# EAGLE design MAAV_Vehicle_12v0 (EAGLE 6.2)

## Sheet 1 of 7
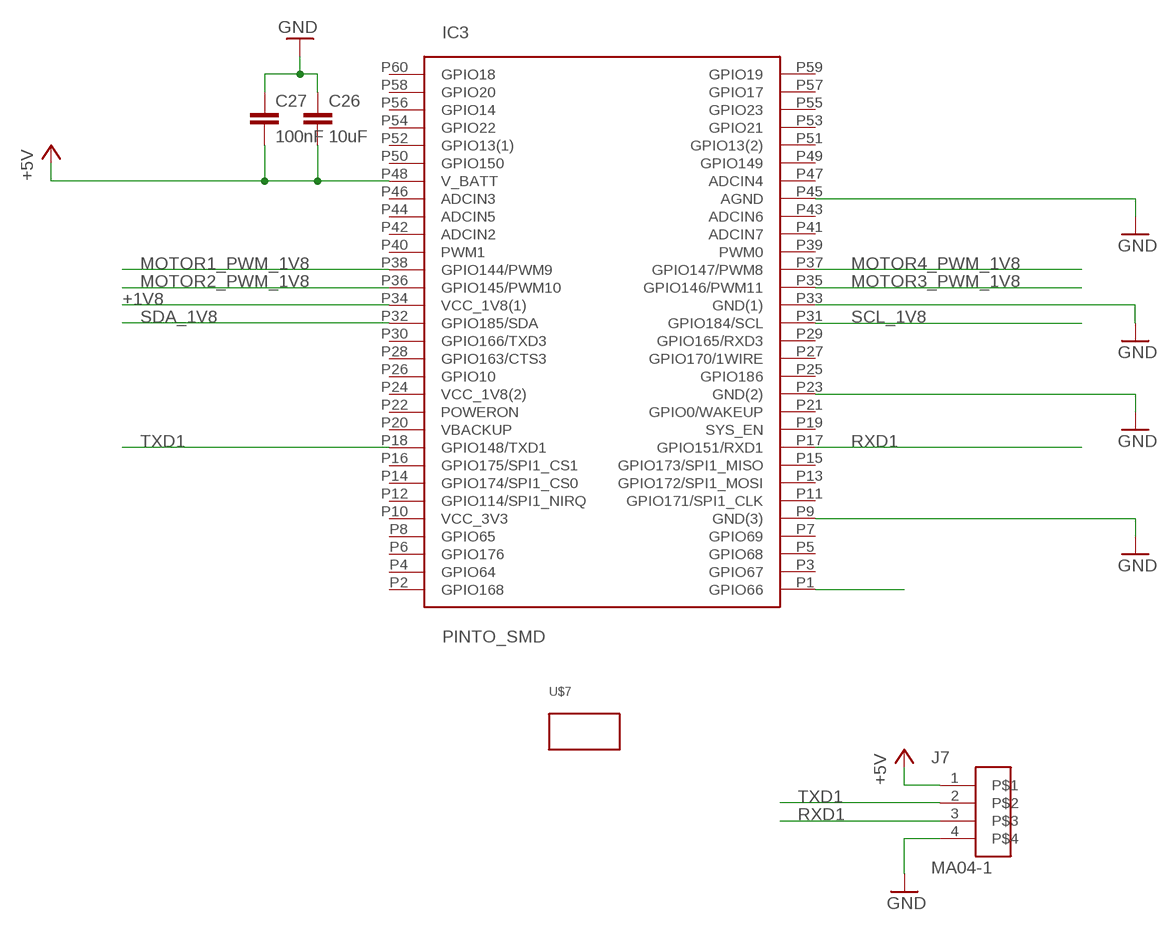
[diagram p0: schematic, sheet 1]

### Parts
C26  10uF  CAP0603-CAP  [0603-CAP]
C27  100nF  CAP0603-CAP  [0603-CAP]
IC3  PINTO_SMD  [PINTO_SMD]
J7  MA04-1  [455-1751-1-ND]
U$7  IMU  [IMU]

### Nets
+1V8: IC3.P34(VCC_1V8(1)) ; also sheet 2
+5V: C26.2 C27.2 IC3.P48(V_BATT) J7.1 ; also sheet 2,3,4,6,7
GND: C26.1 C27.1 IC3.P9(GND(3)) IC3.P23(GND(2)) IC3.P33(GND(1)) IC3.P45(AGND) J7.4 ; also sheet 3,4,5,6,7
MOTOR1_PWM_1V8: IC3.P38(GPIO144/PWM9) ; also sheet 2
MOTOR2_PWM_1V8: IC3.P36(GPIO145/PWM10) ; also sheet 2
MOTOR3_PWM_1V8: IC3.P35(GPIO146/PWM11) ; also sheet 2
MOTOR4_PWM_1V8: IC3.P37(GPIO147/PWM8) ; also sheet 2
N$1: IC3.P1(GPIO66)
RXD1: IC3.P17(GPIO151/RXD1) J7.3
SCL_1V8: IC3.P31(GPIO184/SCL) ; also sheet 2
SDA_1V8: IC3.P32(GPIO185/SDA) ; also sheet 2
TXD1: IC3.P18(GPIO148/TXD1) J7.2
Unconnected: IC3.P2(GPIO168) IC3.P3(GPIO67) IC3.P4(GPIO64) IC3.P5(GPIO68) IC3.P6(GPIO176) IC3.P7(GPIO69) IC3.P8(GPIO65) IC3.P10(VCC_3V3) IC3.P11(GPIO171/SPI1_CLK) IC3.P12(GPIO114/SPI1_NIRQ) IC3.P13(GPIO172/SPI1_MOSI) IC3.P14(GPIO174/SPI1_CS0) IC3.P15(GPIO173/SPI1_MISO) IC3.P16(GPIO175/SPI1_CS1) IC3.P19(SYS_EN) IC3.P20(VBACKUP) IC3.P21(GPIO0/WAKEUP) IC3.P22(POWERON) IC3.P24(VCC_1V8(2)) IC3.P25(GPIO186) IC3.P26(GPIO10) IC3.P27(GPIO170/1WIRE) IC3.P28(GPIO163/CTS3) IC3.P29(GPIO165/RXD3) IC3.P30(GPIO166/TXD3) IC3.P39(PWM0) IC3.P40(PWM1) IC3.P41(ADCIN7) IC3.P42(ADCIN2) IC3.P43(ADCIN6) IC3.P44(ADCIN5) IC3.P46(ADCIN3) IC3.P47(ADCIN4) IC3.P49(GPIO149) IC3.P50(GPIO150) IC3.P51(GPIO13(2)) IC3.P52(GPIO13(1)) IC3.P53(GPIO21) IC3.P54(GPIO22) IC3.P55(GPIO23) IC3.P56(GPIO14) IC3.P57(GPIO17) IC3.P58(GPIO20) IC3.P59(GPIO19) IC3.P60(GPIO18)

## Sheet 2 of 7
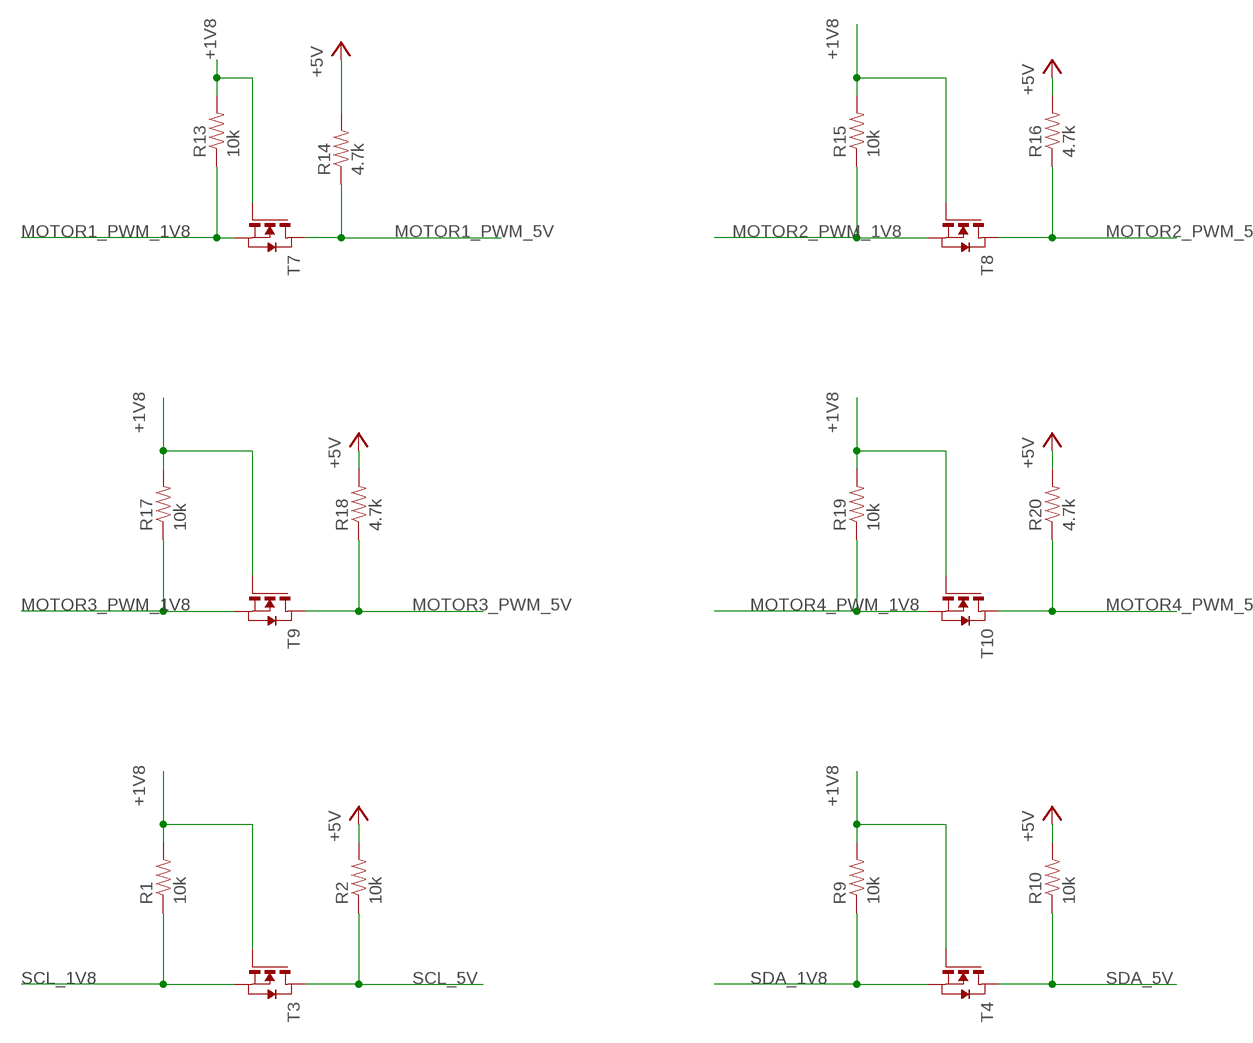
[diagram p1: schematic, sheet 2]

### Parts
R1  10k  RESISTOR0603-RES  [0603-RES]
R2  10k  RESISTOR0603-RES  [0603-RES]
R9  10k  RESISTOR0603-RES  [0603-RES]
R10  10k  RESISTOR0603-RES  [0603-RES]
R13  10k  RESISTOR0603-RES  [0603-RES]
R14  4.7k  RESISTOR0603-RES  [0603-RES]
R15  10k  RESISTOR0603-RES  [0603-RES]
R16  4.7k  RESISTOR0603-RES  [0603-RES]
R17  10k  RESISTOR0603-RES  [0603-RES]
R18  4.7k  RESISTOR0603-RES  [0603-RES]
R19  10k  RESISTOR0603-RES  [0603-RES]
R20  4.7k  RESISTOR0603-RES  [0603-RES]
T3  NMOSSOT23  [SOT-23]
T4  NMOSSOT23  [SOT-23]
T7  NMOSSOT23  [SOT-23]
T8  NMOSSOT23  [SOT-23]
T9  NMOSSOT23  [SOT-23]
T10  NMOSSOT23  [SOT-23]

### Nets
+1V8: R1.2 R9.2 R13.2 R15.2 R17.2 R19.2 T3.3(G) T4.3(G) T7.3(G) T8.3(G) T9.3(G) T10.3(G) ; also sheet 1
+5V: R2.2 R10.2 R14.2 R16.2 R18.2 R20.2 ; also sheet 1,3,4,6,7
MOTOR1_PWM_1V8: R13.1 T7.2(S) ; also sheet 1
MOTOR1_PWM_5V: R14.1 T7.1(D) ; also sheet 5
MOTOR2_PWM_1V8: R15.1 T8.2(S) ; also sheet 1
MOTOR2_PWM_5V: R16.1 T8.1(D) ; also sheet 5
MOTOR3_PWM_1V8: R17.1 T9.2(S) ; also sheet 1
MOTOR3_PWM_5V: R18.1 T9.1(D) ; also sheet 5
MOTOR4_PWM_1V8: R19.1 T10.2(S) ; also sheet 1
MOTOR4_PWM_5V: R20.1 T10.1(D) ; also sheet 5
SCL_1V8: R1.1 T3.2(S) ; also sheet 1
SCL_5V: R2.1 T3.1(D) ; also sheet 3
SDA_1V8: R9.1 T4.2(S) ; also sheet 1
SDA_5V: R10.1 T4.1(D) ; also sheet 3

## Sheet 3 of 7
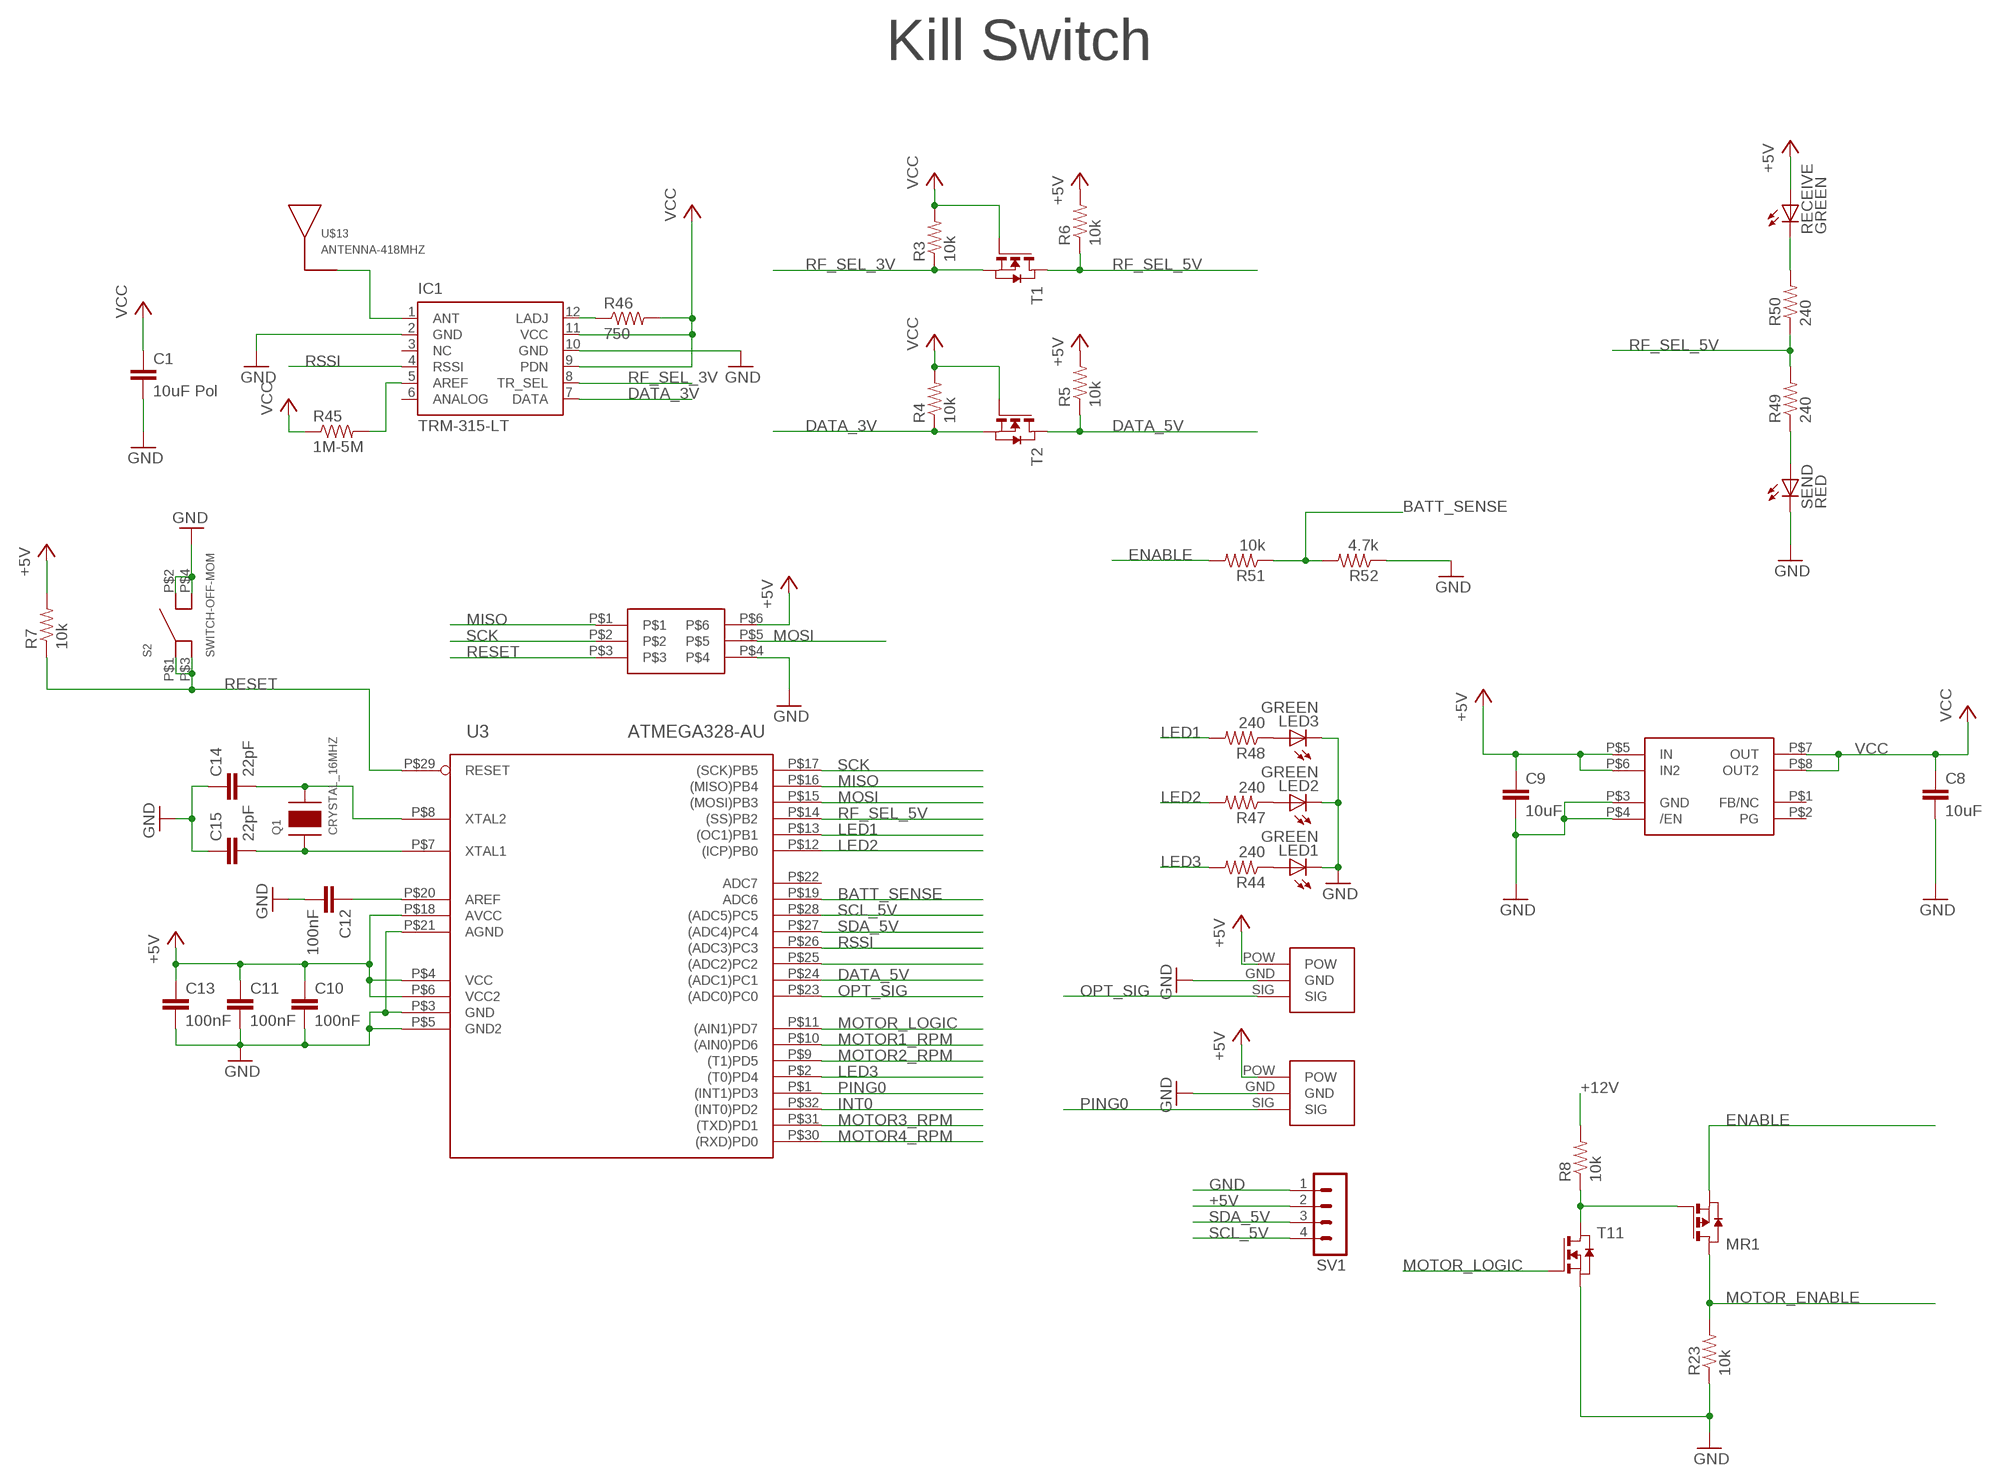
[diagram p2: schematic, sheet 3]

### Parts
C1  10uF Pol  CAP0805  [0805]
C8  10uF  CAP0805  [0805]
C9  10uF  CAP0603-CAP  [0603-CAP]
C10  100nF  CAP0603-CAP  [0603-CAP]
C11  100nF  CAP0603-CAP  [0603-CAP]
C12  100nF  CAP0603-CAP  [0603-CAP]
C13  100nF  CAP0603-CAP  [0603-CAP]
C14  22pF  CAP0603-CAP  [0603-CAP]
C15  22pF  CAP0603-CAP  [0603-CAP]
IC1  TRM-315-LT  [TRM-XXX-LT]
J1  MA03-2  [MA03-2]
LED1  GREEN  LED0603  [LED-0603]
LED2  GREEN  LED0603  [LED-0603]
LED3  GREEN  LED0603  [LED-0603]
MR1  PMOSSOT23  [SOT-23]
Q1  CRYSTAL_16MHZ  [CRYSTAL_16MHZ]
R3  10k  RESISTOR0603-RES  [0603-RES]
R4  10k  RESISTOR0603-RES  [0603-RES]
R5  10k  RESISTOR0603-RES  [0603-RES]
R6  10k  RESISTOR0603-RES  [0603-RES]
R7  10k  RESISTOR0603-RES  [0603-RES]
R8  10k  RESISTOR0805-RES  [0805]
R23  10k  RESISTOR0805-RES  [0805]
R44  240  RESISTOR0603-RES  [0603-RES]
R45  1M-5M  RESISTOR0603-RES  [0603-RES]
R46  750  RESISTOR0603-RES  [0603-RES]
R47  240  RESISTOR0603-RES  [0603-RES]
R48  240  RESISTOR0603-RES  [0603-RES]
R49  240  RESISTOR0603-RES  [0603-RES]
R50  240  RESISTOR0603-RES  [0603-RES]
R51  10k  RESISTOR0603-RES  [0603-RES]
R52  4.7k  RESISTOR0603-RES  [0603-RES]
RECEIVE  GREEN  LED0603  [LED-0603]
S2  SWITCH-OFF-MOM  [SWITCH-OFF-MOM]
SEND  RED  LED0603  [LED-0603]
SV1  MA04-1  [MA04-1]
T1  NMOSSOT23  [SOT-23]
T2  NMOSSOT23  [SOT-23]
T11  NMOSSOT23  [SOT-23]
U3  ATMEGA328-AU  [32-TQFP]
U4  REG_3V_8SOIC  [8-SOIC]
U$10  H3894-ND  [H3894-ND]
U$13  ANTENNA-418MHZ  [ANTENNA-418MHZ]
U$16  H3894-ND  [H3894-ND]

### Nets
+5V: C9.1 C10.1 C11.1 C13.1 J1.P$6 R5.2 R6.2 R7.2 RECEIVE.A SV1.2 U3.P$4(VCC) U3.P$6(VCC2) U3.P$18(AVCC) U4.P$5(IN) U4.P$6(IN2) U$10.POW U$16.POW ; also sheet 1,2,4,6,7
+12V: R8.2 ; also sheet 4,5,6
ANTENNA: IC1.1(ANT) U$13.P$1 ; also sheet 7
BATT_SENSE: R51.1 R52.2 U3.P$19(ADC6)
DATA_3V: IC1.7(DATA) R4.1 T2.2(S)
DATA_5V: R5.1 T2.1(D) U3.P$24((ADC1)PC1)
ENABLE: MR1.2(S) R51.2 ; also sheet 4
GND: C1.2 C8.2 C9.2 C10.2 C11.2 C12.2 C13.2 C14.1 C15.1 IC1.2(GND) IC1.10(GND) J1.P$4 LED1.C LED2.C LED3.C R23.1 R52.1 S2.P$2(P2) S2.P$4(P4) SEND.C SV1.1 T11.2(S) U3.P$3(GND) U3.P$5(GND2) U3.P$21(AGND) U4.P$3(GND) U4.P$4(/EN) U$10.GND U$16.GND ; also sheet 1,4,5,6,7
INT0: U3.P$32((INT0)PD2) ; also sheet 7
LED1: R48.2 U3.P$13((OC1)PB1)
LED2: R47.2 U3.P$12((ICP)PB0)
LED3: R44.2 U3.P$2((T0)PD4)
MISO: J1.P$1 U3.P$16((MISO)PB4) ; also sheet 7
MOSI: J1.P$5 U3.P$15((MOSI)PB3) ; also sheet 7
MOTOR1_RPM: U3.P$10((AIN0)PD6) ; also sheet 6
MOTOR2_RPM: U3.P$9((T1)PD5) ; also sheet 6
MOTOR3_RPM: U3.P$31((TXD)PD1) ; also sheet 6
MOTOR4_RPM: U3.P$30((RXD)PD0) ; also sheet 6
MOTOR_ENABLE: MR1.1(D) R23.2 ; also sheet 5
MOTOR_LOGIC: T11.3(G) U3.P$11((AIN1)PD7)
N$2: LED1.A R44.1
N$3: C12.1 U3.P$20(AREF)
N$5: MR1.3(G) R8.1 T11.1(D)
N$6: C14.2 Q1.P$2 U3.P$8(XTAL2)
N$8: C15.2 Q1.P$1 U3.P$7(XTAL1)
N$10: R50.2 RECEIVE.C
N$23: R49.1 SEND.A
N$24: U3.P$25((ADC2)PC2)
N$29: IC1.5(AREF) R45.2
N$30: IC1.12(LADJ) R46.1
N$33: LED2.A R47.1
N$34: LED3.A R48.1
OPT_SIG: U3.P$23((ADC0)PC0) U$16.SIG
PING0: U3.P$1((INT1)PD3) U$10.SIG
RESET: J1.P$3 R7.1 S2.P$1(P1) S2.P$3(P3) U3.P$29(RESET)
RF_SEL_3V: IC1.8(TR_SEL) R3.1 T1.2(S)
RF_SEL_5V: R6.1 R49.2 R50.1 T1.1(D) U3.P$14((SS)PB2) ; also sheet 7
RSSI: IC1.4(RSSI) U3.P$26((ADC3)PC3)
SCK: J1.P$2 U3.P$17((SCK)PB5) ; also sheet 7
SCL_5V: SV1.4 U3.P$28((ADC5)PC5) ; also sheet 2
SDA_5V: SV1.3 U3.P$27((ADC4)PC4) ; also sheet 2
VCC: C1.1 C8.1 IC1.9(PDN) IC1.11(VCC) R3.2 R4.2 R45.1 R46.2 T1.3(G) T2.3(G) U4.P$7(OUT) U4.P$8(OUT2)
Unconnected: IC1.3(NC) IC1.6(ANALOG) U3.P$22(ADC7) U4.P$1(FB/NC) U4.P$2(PG)

### Notes on the sheet
- Kill Switch

## Sheet 4 of 7
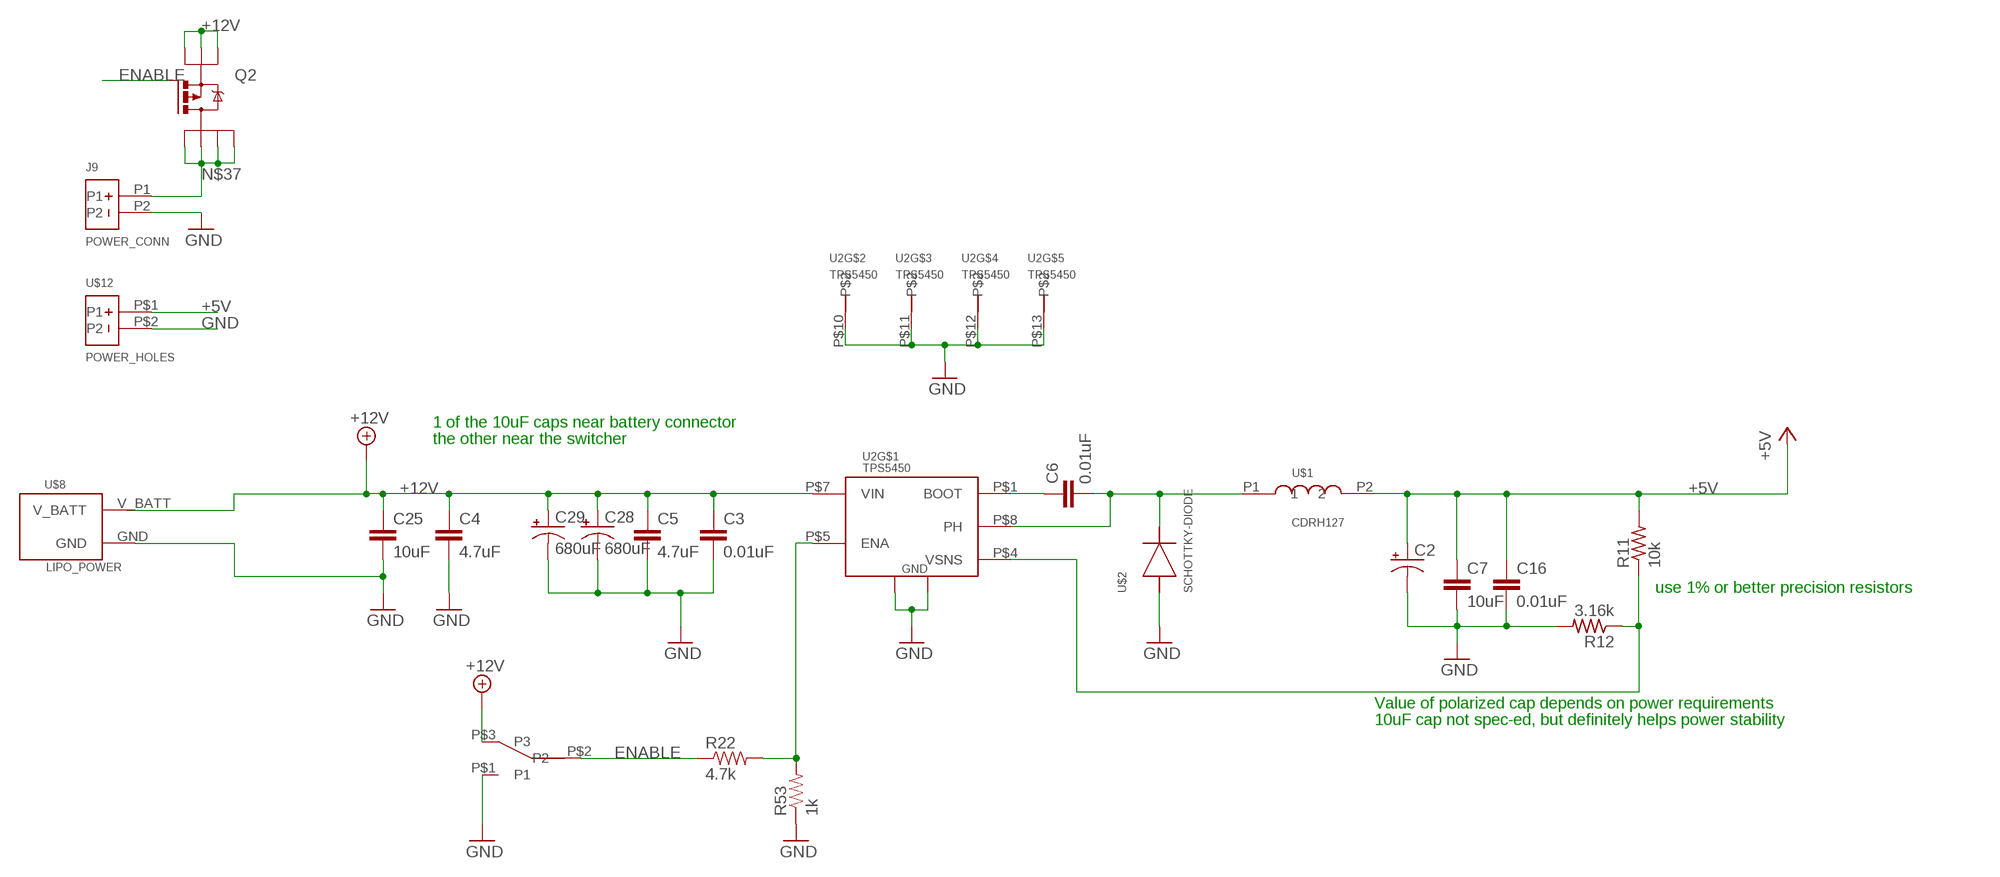
[diagram p3: schematic, sheet 4]

### Parts
C2  CAP_POL  [2917]
C3  0.01uF  C-EUC1210  [C1210]
C4  4.7uF  C-EUC1210  [C1210]
C5  4.7uF  C-EUC1210  [C1210]
C6  0.01uF  C-EUC1210  [C1210]
C7  10uF  C-EUC1210  [C1210]
C16  0.01uF  C-EUC1210  [C1210]
C25  10uF  C-EUC1210  [C1210]
C28  680uF  CPOL-USE22-9AXIAL  [EH22-9]
C29  680uF  CPOL-USE22-9AXIAL  [EH22-9]
J9  POWER_CONN  [POWER_CONN]
Q2  P-MOSFET-SO8  [SO-08]
R11  10k  R-US_R0603  [R0603]
R12  3.16k  R-US_R0603  [R0603]
R22  4.7k  RESISTOR0805-RES  [0805]
R53  1k  RESISTOR0805-RES  [0805]
S1  SWITCH-ON-ON  [SWITCH-ON-ON]
U2  TPS5450  [TPS5450]
U$1  CDRH127  [CDRH127]
U$2  SCHOTTKY-DIODE  [DO-214AB,SMC]
U$8  LIPO_POWER  [LIPO_POWER]
U$12  POWER_HOLES  [POWER_HOLES]

### Nets
+5V: C2.2(+) C7.1 C16.1 R11.2 U$1.P2 U$12.P$1(P1) ; also sheet 1,2,3,6,7
+12V: C3.1 C4.1 C5.1 C25.1 C28.+ C29.+ Q2.1(S) Q2.2(S) Q2.3(S) S1.P$3(P3) U2.P$7(VIN) U$8.V_BATT ; also sheet 3,5,6
ENABLE: Q2.4(G) R22.1 S1.P$2(P2) ; also sheet 3
GND: C2.1(-) C3.2 C4.2 C5.2 C7.2 C16.2 C25.2 C28.- C29.- J9.P2 R12.2 R53.1 S1.P$1(P1) U2.P$6(GND) U2.P$9(PGND) U2.P$10 U2.P$11 U2.P$12 U2.P$13 U$2.P$1 U$8.GND U$12.P$2(P2) ; also sheet 1,3,5,6,7
N$4: R11.1 R12.1 U2.P$4(VSNS)
N$9: C6.1 U2.P$1(BOOT)
N$11: R22.2 R53.2 U2.P$5(ENA)
N$28: C6.2 U2.P$8(PH) U$1.P1 U$2.P$2
N$37: J9.P1 Q2.5(D) Q2.6(D) Q2.7(D) Q2.8(D)

### Notes on the sheet
- 1 of the 10uF caps near battery connector
- the other near the switcher
- use 1% or better precision resistors
- Value of polarized cap depends on power requirements
- 10uF cap not spec-ed, but definitely helps power stability

## Sheet 5 of 7
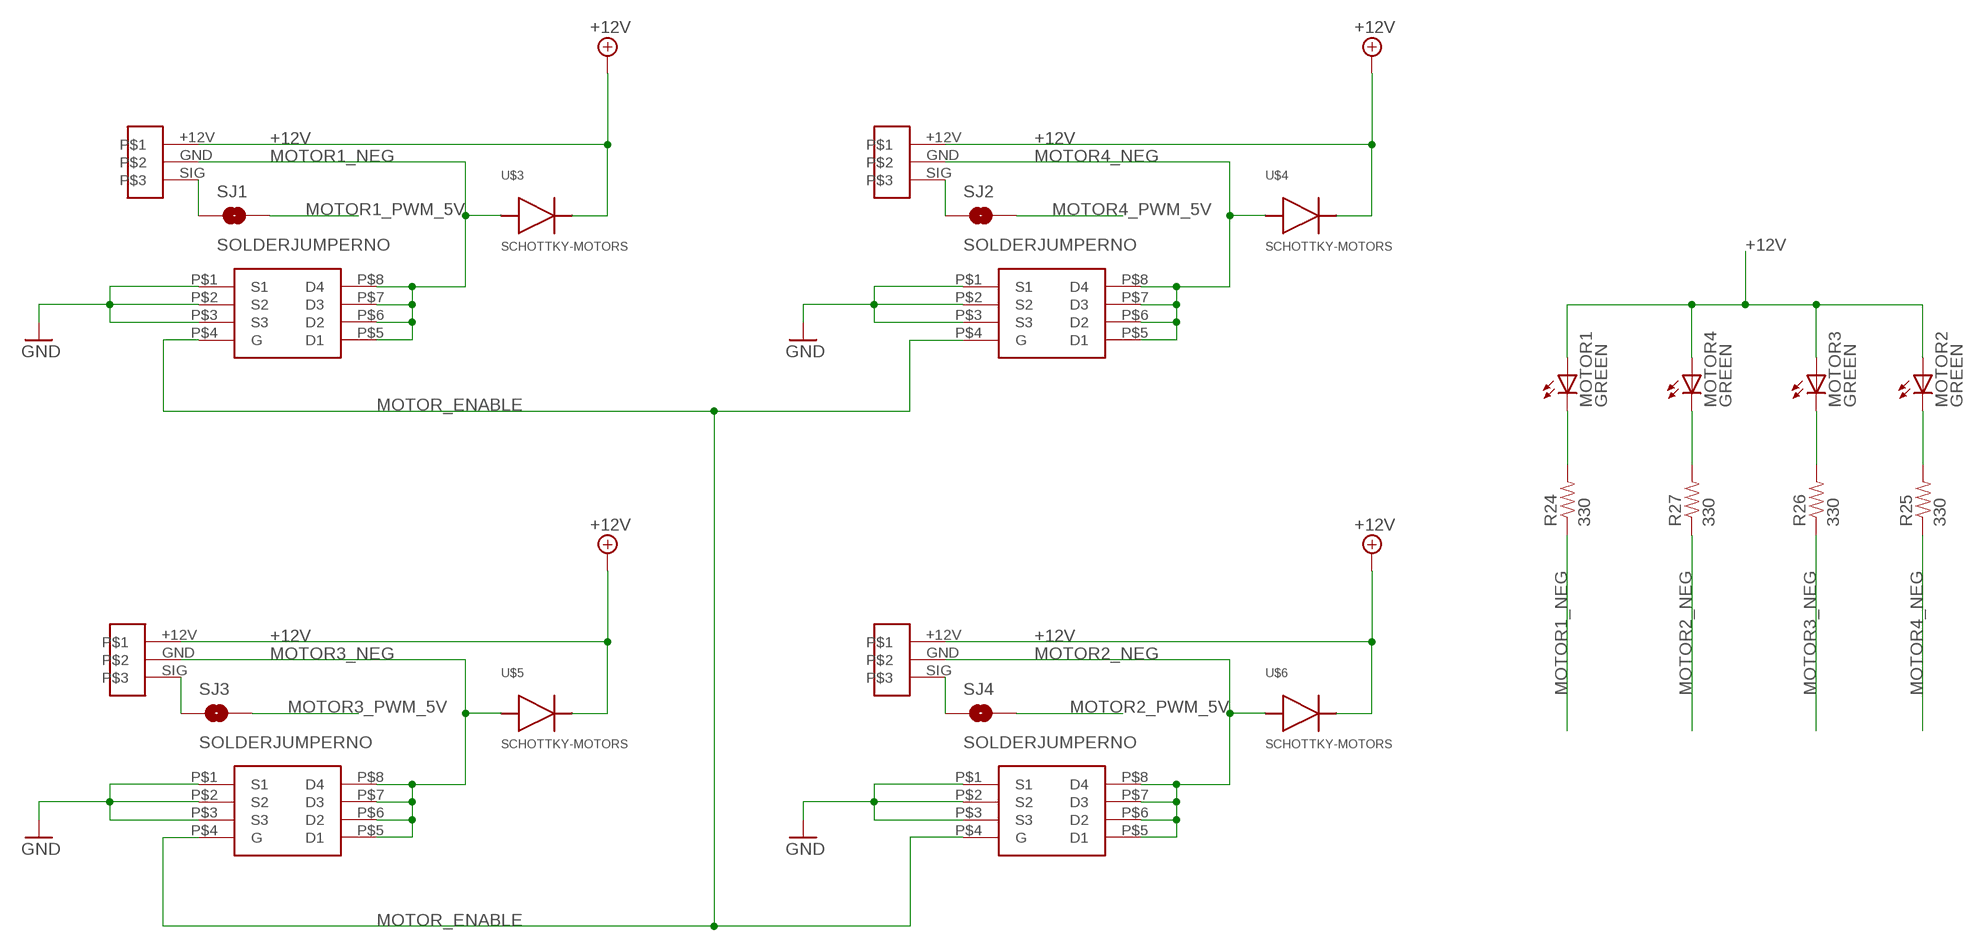
[diagram p4: schematic, sheet 5]

### Parts
J2  MOTOR_CONNTRU_HOLE  [MOTOR_CONN_THRU]
J3  MOTOR_CONNTRU_HOLE  [MOTOR_CONN_THRU]
J4  MOTOR_CONNTRU_HOLE  [MOTOR_CONN_THRU]
J5  MOTOR_CONNTRU_HOLE  [MOTOR_CONN_THRU]
MOTOR1  GREEN  LEDCHIPLED_0805  [CHIPLED_0805]
MOTOR2  GREEN  LEDCHIPLED_0805  [CHIPLED_0805]
MOTOR3  GREEN  LEDCHIPLED_0805  [CHIPLED_0805]
MOTOR4  GREEN  LEDCHIPLED_0805  [CHIPLED_0805]
R24  330  RESISTOR0805-RES  [0805]
R25  330  RESISTOR0805-RES  [0805]
R26  330  RESISTOR0805-RES  [0805]
R27  330  RESISTOR0805-RES  [0805]
SJ1  SOLDERJUMPERNO  [SJ_2S-NO]
SJ2  SOLDERJUMPERNO  [SJ_2S-NO]
SJ3  SOLDERJUMPERNO  [SJ_2S-NO]
SJ4  SOLDERJUMPERNO  [SJ_2S-NO]
T5  MOTOR_NFET  [8-SOIC]
T6  MOTOR_NFET  [8-SOIC]
T12  MOTOR_NFET  [8-SOIC]
T13  MOTOR_NFET  [8-SOIC]
U$3  SCHOTTKY-MOTORS  [DO-214AC,SMA]
U$4  SCHOTTKY-MOTORS  [DO-214AC,SMA]
U$5  SCHOTTKY-MOTORS  [DO-214AC,SMA]
U$6  SCHOTTKY-MOTORS  [DO-214AC,SMA]

### Nets
+12V: J2.+12V J3.+12V J4.+12V J5.+12V MOTOR1.A MOTOR2.A MOTOR3.A MOTOR4.A U$3.P$2 U$4.P$2 U$5.P$2 U$6.P$2 ; also sheet 3,4,6
GND: T5.P$1(S1) T5.P$2(S2) T5.P$3(S3) T6.P$1(S1) T6.P$2(S2) T6.P$3(S3) T12.P$1(S1) T12.P$2(S2) T12.P$3(S3) T13.P$1(S1) T13.P$2(S2) T13.P$3(S3) ; also sheet 1,3,4,6,7
MOTOR1_NEG: J2.GND R24.1 T5.P$5(D1) T5.P$6(D2) T5.P$7(D3) T5.P$8(D4) U$3.P$1
MOTOR1_PWM_5V: SJ1.2 ; also sheet 2
MOTOR2_NEG: J5.GND R27.1 T13.P$5(D1) T13.P$6(D2) T13.P$7(D3) T13.P$8(D4) U$6.P$1
MOTOR2_PWM_5V: SJ4.2 ; also sheet 2
MOTOR3_NEG: J3.GND R26.1 T12.P$5(D1) T12.P$6(D2) T12.P$7(D3) T12.P$8(D4) U$5.P$1
MOTOR3_PWM_5V: SJ3.2 ; also sheet 2
MOTOR4_NEG: J4.GND R25.1 T6.P$5(D1) T6.P$6(D2) T6.P$7(D3) T6.P$8(D4) U$4.P$1
MOTOR4_PWM_5V: SJ2.2 ; also sheet 2
MOTOR_ENABLE: T5.P$4(G) T6.P$4(G) T12.P$4(G) T13.P$4(G) ; also sheet 3
N$12: MOTOR1.C R24.2
N$13: MOTOR2.C R25.2
N$14: MOTOR3.C R26.2
N$15: MOTOR4.C R27.2
N$25: J2.SIG SJ1.1
N$31: J5.SIG SJ4.1
N$32: J4.SIG SJ2.1
N$35: J3.SIG SJ3.1

## Sheet 6 of 7
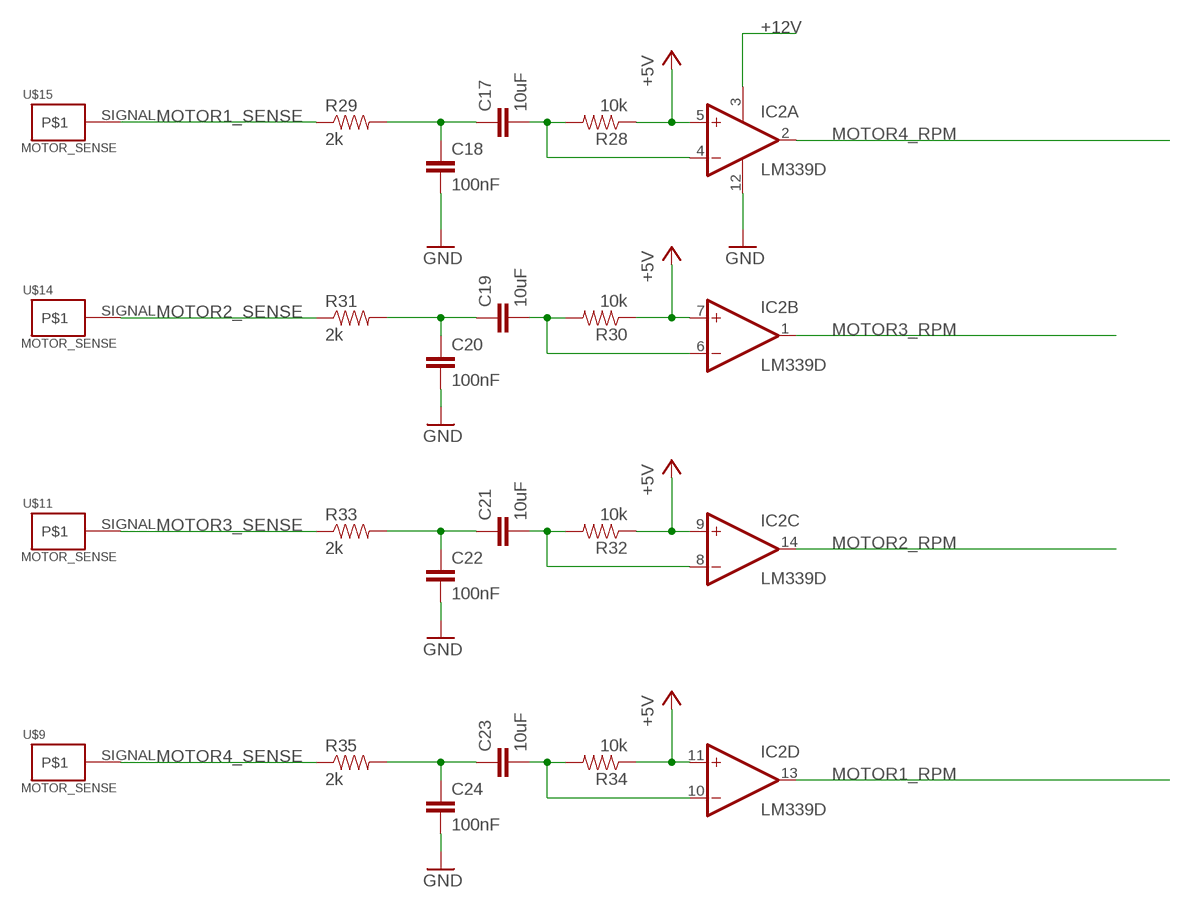
[diagram p5: schematic, sheet 6]

### Parts
C17  10uF  CAP0603-CAP  [0603-CAP]
C18  100nF  CAP0603-CAP  [0603-CAP]
C19  10uF  CAP0603-CAP  [0603-CAP]
C20  100nF  CAP0603-CAP  [0603-CAP]
C21  10uF  CAP0603-CAP  [0603-CAP]
C22  100nF  CAP0603-CAP  [0603-CAP]
C23  10uF  CAP0603-CAP  [0603-CAP]
C24  100nF  CAP0603-CAP  [0603-CAP]
IC2  LM339D  [SO14]
R28  10k  RESISTOR0603-RES  [0603-RES]
R29  2k  RESISTOR0603-RES  [0603-RES]
R30  10k  RESISTOR0603-RES  [0603-RES]
R31  2k  RESISTOR0603-RES  [0603-RES]
R32  10k  RESISTOR0603-RES  [0603-RES]
R33  2k  RESISTOR0603-RES  [0603-RES]
R34  10k  RESISTOR0603-RES  [0603-RES]
R35  2k  RESISTOR0603-RES  [0603-RES]
U$9  MOTOR_SENSE  [MOTOR_SENSE]
U$11  MOTOR_SENSE  [MOTOR_SENSE]
U$14  MOTOR_SENSE  [MOTOR_SENSE]
U$15  MOTOR_SENSE  [MOTOR_SENSE]

### Nets
+5V: IC2.5(A:+IN) IC2.7(B:+IN) IC2.9(C:+IN) IC2.11(D:+IN) R28.1 R30.1 R32.1 R34.1 ; also sheet 1,2,3,4,7
+12V: IC2.3(P:V+) ; also sheet 3,4,5
GND: C18.2 C20.2 C22.2 C24.2 IC2.12(P:GND) ; also sheet 1,3,4,5,7
MOTOR1_RPM: IC2.13(D:OUT) ; also sheet 3
MOTOR1_SENSE: R29.1 U$15.SIGNAL
MOTOR2_RPM: IC2.14(C:OUT) ; also sheet 3
MOTOR2_SENSE: R31.1 U$14.SIGNAL
MOTOR3_RPM: IC2.1(B:OUT) ; also sheet 3
MOTOR3_SENSE: R33.1 U$11.SIGNAL
MOTOR4_RPM: IC2.2(A:OUT) ; also sheet 3
MOTOR4_SENSE: R35.1 U$9.SIGNAL
N$7: C19.1 C20.1 R31.2
N$16: C17.2 IC2.4(A:-IN) R28.2
N$17: C17.1 C18.1 R29.2
N$18: C19.2 IC2.6(B:-IN) R30.2
N$19: C21.1 C22.1 R33.2
N$20: C21.2 IC2.8(C:-IN) R32.2
N$21: C23.1 C24.1 R35.2
N$22: C23.2 IC2.10(D:-IN) R34.2

## Sheet 7 of 7
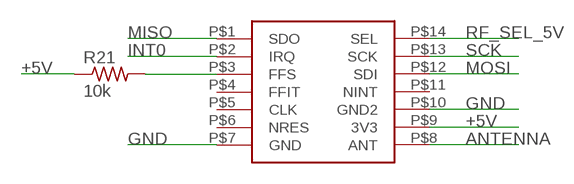
[diagram p6: schematic, sheet 7]

### Parts
R21  10k  R-US_R0603  [R0603]
U$17  RF12  [RF12]

### Nets
+5V: R21.1 U$17.P$9(3V3) ; also sheet 1,2,3,4,6
ANTENNA: U$17.P$8(ANT) ; also sheet 3
GND: U$17.P$7(GND) U$17.P$10(GND2) ; also sheet 1,3,4,5,6
INT0: U$17.P$2(IRQ) ; also sheet 3
MISO: U$17.P$1(SDO) ; also sheet 3
MOSI: U$17.P$12(SDI) ; also sheet 3
N$26: R21.2 U$17.P$3(FFS)
RF_SEL_5V: U$17.P$14(SEL) ; also sheet 3
SCK: U$17.P$13(SCK) ; also sheet 3
Unconnected: U$17.P$4(FFIT) U$17.P$5(CLK) U$17.P$6(NRES) U$17.P$11(NINT)

## Library data of the parts
C1 = SparkFun:CAP: Capacitor Standard 0603 ceramic capacitor, and 0.1" leaded capacitor.; DIGIKEY: 478-3273-1-ND
C2 = SparkFun:CAP_POL: Capacitor Polarized These are standard SMD and PTH capacitors. Normally 10uF, 47uF, and 100uF in electrolytic and tantalum varieties. Always verify the external diameter of the through hole cap, it varies with capacity, voltage, and manufacturer. The EIA devices should be standard.; DIGIKEY: 478-1811-1-ND
C3 C6 C16 = resistor:C-EU: CAPACITOR, European symbol; DIGIKEY: 478-1601-1-ND
C4 C5 = resistor:C-EU: CAPACITOR, European symbol; DIGIKEY: 399-5777-1-ND
C7 C25 = resistor:C-EU: CAPACITOR, European symbol; DIGIKEY: 445-1597-1-ND
C8 = SparkFun:CAP: Capacitor Standard 0603 ceramic capacitor, and 0.1" leaded capacitor.; DIGIKEY: 490-1746-1-ND
C9 C17 C19 C21 C23 C26 = SparkFun:CAP: Capacitor Standard 0603 ceramic capacitor, and 0.1" leaded capacitor.; DIGIKEY: 445-4112-1-ND
C10-C13 C18 C20 C22 C24 C27 = SparkFun:CAP: Capacitor Standard 0603 ceramic capacitor, and 0.1" leaded capacitor.; DIGIKEY: 478-1239-1-ND
C14 C15 = SparkFun:CAP: Capacitor Standard 0603 ceramic capacitor, and 0.1" leaded capacitor.; DIGIKEY: 478-6200-1-ND
C28 C29 = MAAV:CPOL-US: POLARIZED CAPACITOR, American symbol; DIGIKEY: P12378-ND
IC1 = linx:TRM-*-LT: LT SERIES TRANSCEIVER MODULE bidirectional wireless transfer serial data Source: www.linxtechnologies.com .. TRM-xxx-LT_Data_Guide.pdf; DIGIKEY: TRM-315-LT-ND; OC_FARNELL: unknown; OC_NEWARK: unknown
IC2 = linear:LM339: Low Power Low Offset Voltage Quad Comparators with open collector; LM139/LM239/LM339/LM2901/LM3302; DIGIKEY: 296-1013-1-ND
IC3 = MAAV:PINTO_SMD; DIGIKEY: S5641-ND (6); DIGIKEY_ASSOC: S9218-ND (2)
J1 = MAAV:MA03-2
J2-J5 = MAAV:MOTOR_CONN
J7 = MAAV:MA04-1
J9 = MAAV:POWER_CONN; DIGIKEY: A30614-ND
LED1-LED3 RECEIVE = SparkFun:LED: LEDs Standard schematic elements and footprints for 5mm, 3mm, 1206, and 0603 sized LEDs. 5mm - Spark Fun Electronics SKU : COM-00529 (and others); DIGIKEY: 1080-1405-1-ND
MOTOR1-MOTOR4 = led:LED: LED OSRAM: - CHIPLED LG R971, LG N971, LY N971, LG Q971, LY Q971, LO R971, LY R971 LH N974, LH R974 LS Q976, LO Q976, LY Q976 LO Q996 - Hyper CHIPLED LW Q18S LB Q993, LB Q99A, LB R99A - SideLED LS A670, LO A670, LY A670, LG A670, LP A670 LB A673, LV A673, LT A673, LW A673 LH A674 LY A675 LS A676, LA A676, LO A676, LY A676, LW A676 LS A679, LY A679, LG A679 - Hyper Micro SIDELED® LS Y876, LA Y876, LO Y876, LY Y876 LT Y87S - SmartLED LW L88C, LW L88S LB L89C, LB L89S, LG L890 LS L89K, LO L89K, LY L89K LS L896, LA L896, LO L896, LY L896 - TOPLED LS T670, LO T670, LY T670, LG T670, LP T670 LSG T670, LSP T670, LSY T670, LOP T670, LYG T670 LG T671, LOG T671, LSG T671 LB T673, LV T673, LT T673, LW T673 LH T674 LS T676, LA T676, LO T676, LY T676, LB T676, LH T676, LSB T676, LW T676 LB T67C, LV T67C, LT T67C, LS T67K, LO T67K, LY T67K, LW E67C LS E67B, LA E67B, LO E67B, LY E67B, LB E67C, LV E67C, LT E67C LW T67C LS T679, LY T679, LG T679 LS T770, LO T770, LY T770, LG T770, LP T770 LB T773, LV T773, LT T773, LW T773 LH T774 LS E675, LA E675, LY E675, LS T675 LS T776, LA T776, LO T776, LY T776, LB T776 LHGB T686 LT T68C, LB T68C - Hyper Mini TOPLED® LB M676 - Mini TOPLED Santana® LG M470 LS M47K, LO M47K, LY M47K Source: http://www.osram.convergy.de LUXEON: - LUMILED® LXK2-PW12-R00, LXK2-PW12-S00, LXK2-PW14-U00, LXK2-PW14-V00 LXK2-PM12-R00, LXK2-PM12-S00, LXK2-PM14-U00 LXK2-PE12-Q00, LXK2-PE12-R00, LXK2-PE12-S00, LXK2-PE14-T00, LXK2-PE14-U00 LXK2-PB12-K00, LXK2-PB12-L00, LXK2-PB12-M00, LXK2-PB14-N00, LXK2-PB14-P00, LXK2-PB14-Q00 LXK2-PR12-L00, LXK2-PR12-M00, LXK2-PR14-Q00, LXK2-PR14-R00 LXK2-PD12-Q00, LXK2-PD12-R00, LXK2-PD12-S00 LXK2-PH12-R00, LXK2-PH12-S00 LXK2-PL12-P00, LXK2-PL12-Q00, LXK2-PL12-R00 Source: www.luxeon.com KINGBRIGHT: KA-3528ASYC Source: www.kingbright.com; DIGIKEY: 160-1423-1-ND
MR1 = zetex:PMOSSOT23: MOS FET; DIGIKEY: FDV304PCT-ND; OC_FARNELL: unknown; OC_NEWARK: unknown
Q1 = MAAV:CRYSTAL_16MHZ; DIGIKEY: 300-8499-ND
Q2 = MAAV:P-MOSFET-SO8: P-Channel MOSFET Example: FDS4435A; P-Channel Logic Level PowerTrench® MOSFET FDS4465; P-Channel 1.8V Specified PowerTrench® MOSFET Source: www.fairchildsemi.com; DIGIKEY: SI4114DY-T1-GE3CT-ND
R1-R7 R9 R10 R13-R20 R28 R30 R32 R34 = SparkFun:RESISTOR: Resistor Basic schematic elements and footprints for 0603, 1206, and PTH resistors.; DIGIKEY: P10KGCT-ND
R8 R23 = SparkFun:RESISTOR: Resistor Basic schematic elements and footprints for 0603, 1206, and PTH resistors.; DIGIKEY: P10KACT-ND
R11 = resistor:R-US_: RESISTOR, American symbol; DIGIKEY: P10KDBCT-ND
R12 = resistor:R-US_: RESISTOR, American symbol; DIGIKEY: 311-3.16KDCT-ND
R21 = rcl:R-US_: RESISTOR, American symbol
R22 = SparkFun:RESISTOR: Resistor Basic schematic elements and footprints for 0603, 1206, and PTH resistors.; DIGIKEY: P4.7KACT-ND
R24-R27 = SparkFun:RESISTOR: Resistor Basic schematic elements and footprints for 0603, 1206, and PTH resistors.; DIGIKEY: P330ADCT-ND
R29 R31 R33 R35 = SparkFun:RESISTOR: Resistor Basic schematic elements and footprints for 0603, 1206, and PTH resistors.; DIGIKEY: P2.0KGCT-ND
R44 R47-R51 = SparkFun:RESISTOR: Resistor Basic schematic elements and footprints for 0603, 1206, and PTH resistors.; DIGIKEY: P240GCT-ND
R45 = SparkFun:RESISTOR: Resistor Basic schematic elements and footprints for 0603, 1206, and PTH resistors.; DIGIKEY: P1.0MGCT-ND; DIGIKEY_ASSOC: P5.1MGCT-ND
R46 = SparkFun:RESISTOR: Resistor Basic schematic elements and footprints for 0603, 1206, and PTH resistors.; DIGIKEY: P0.0GCT-ND
R52 = SparkFun:RESISTOR: Resistor Basic schematic elements and footprints for 0603, 1206, and PTH resistors.; DIGIKEY: P4.7KGCT-ND
R53 = SparkFun:RESISTOR: Resistor Basic schematic elements and footprints for 0603, 1206, and PTH resistors.; DIGIKEY: P1.0KACT-ND
S1 = MAAV:SWITCH-ON-ON; DIGIKEY: EG1917-ND
S2 = p498:SWITCH-OFF-MOM; DIGIKEY: P11084SCT-ND
SEND = SparkFun:LED: LEDs Standard schematic elements and footprints for 5mm, 3mm, 1206, and 0603 sized LEDs. 5mm - Spark Fun Electronics SKU : COM-00529 (and others); DIGIKEY: 1080-1400-1-ND
SJ1-SJ4 = SparkFun:SOLDERJUMPER: Solder Jumper Standard SMD solder jumper. Used to automate production. Two varients : Normally Open and Normally Closed are the same, but have different paste layers. NC will have a large amount of paste and should jumper during reflow.
SV1 = con-lstb:MA04-1: PIN HEADER; OC_FARNELL: unknown; OC_NEWARK: unknown
T1-T4 T7-T11 = zetex:NMOSSOT23: MOS FET; DIGIKEY: BSS138KCT-ND; OC_FARNELL: unknown; OC_NEWARK: unknown
T5 T6 T12 T13 = MAAV:MOTOR_NFET; DIGIKEY: SI4114DY-T1-GE3CT-ND
U2 = MAAV:TPS5450; DIGIKEY: 296-23750-1-ND
U3 = MAAV:ATMEGA328-AU; DIGIKEY: ATMEGA328-AU-ND
U4 = MAAV:REG_3V_8SOIC; DIGIKEY: 296-2719-5-ND
U$1 = MAAV:CDRH127; DIGIKEY: 308-1333-1-ND
U$2 = MAAV:SCHOTTKY-DIODE: Digi-Key Part Number: B540C-FDICT-ND Category: Discrete Semiconductor Products Family: Diodes, Rectifiers - Single Diode Type: Schottky Voltage - DC Reverse (Vr) (Max): 40V Current - Average Rectified (Io): 5A Voltage - Forward (Vf) (Max) @ If: 550mV @ 5A Speed Fast Recovery: =< 500ns, > 200mA (Io) Current - Reverse Leakage @ Vr: 500µA @ 40V Capacitance @ Vr, F: 300pF @ 4V, 1MHz Mounting Type: Surface Mount Package / Case: DO-214AB, SMC Supplier Device Package: SMC; DIGIKEY: B540C-FDICT-ND
U$3-U$6 = MAAV:SCHOTTKY-MOTORS; DIGIKEY: RSX501L-20TE25CT-ND
U$7 = MAAV:IMU
U$8 = MAAV:LIPO_POWER
U$9 U$11 U$14 U$15 = MAAV:MOTOR_SENSE
U$10 U$16 = MAAV:H3894-ND; DIGIKEY: H3894-ND
U$12 = MAAV:POWER_HOLES
U$13 = MAAV:ANTENNA-418MHZ; DIGIKEY: ANT-418-PW-LP-ND
U$17 = MAAV:RF12

## Board
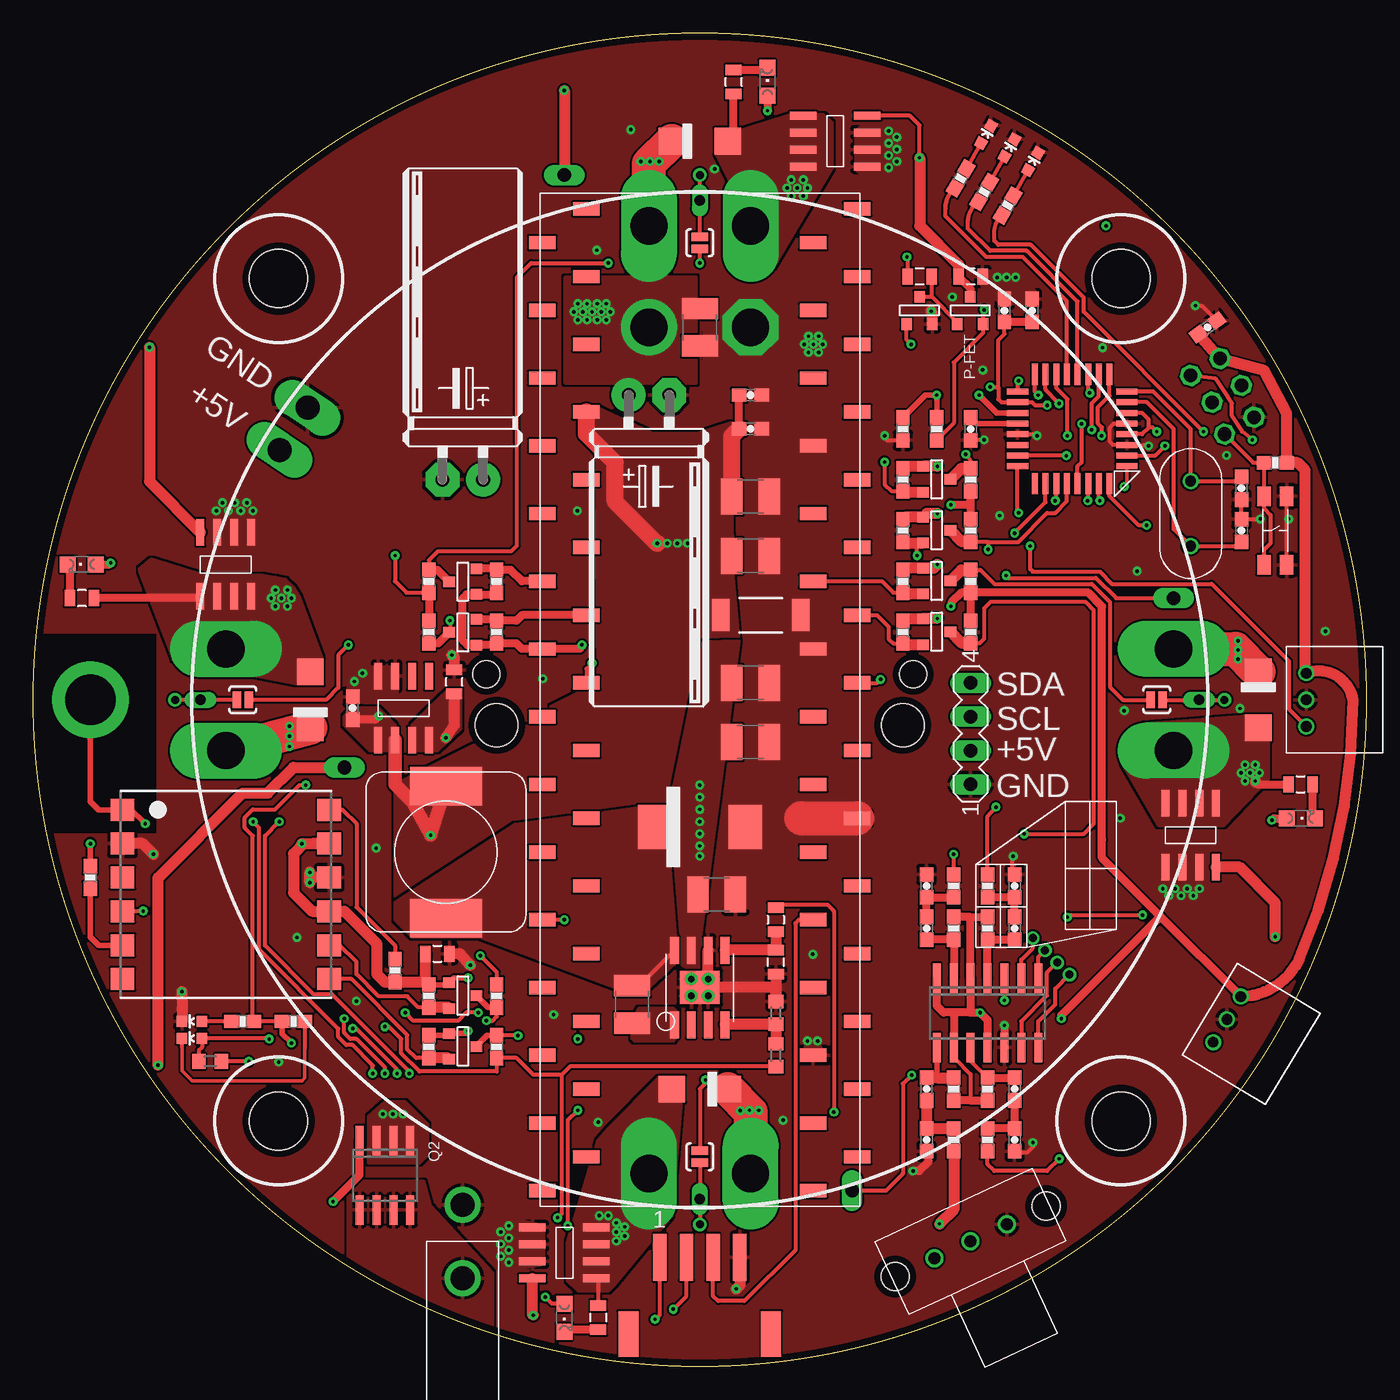
[diagram p7: board, top side]
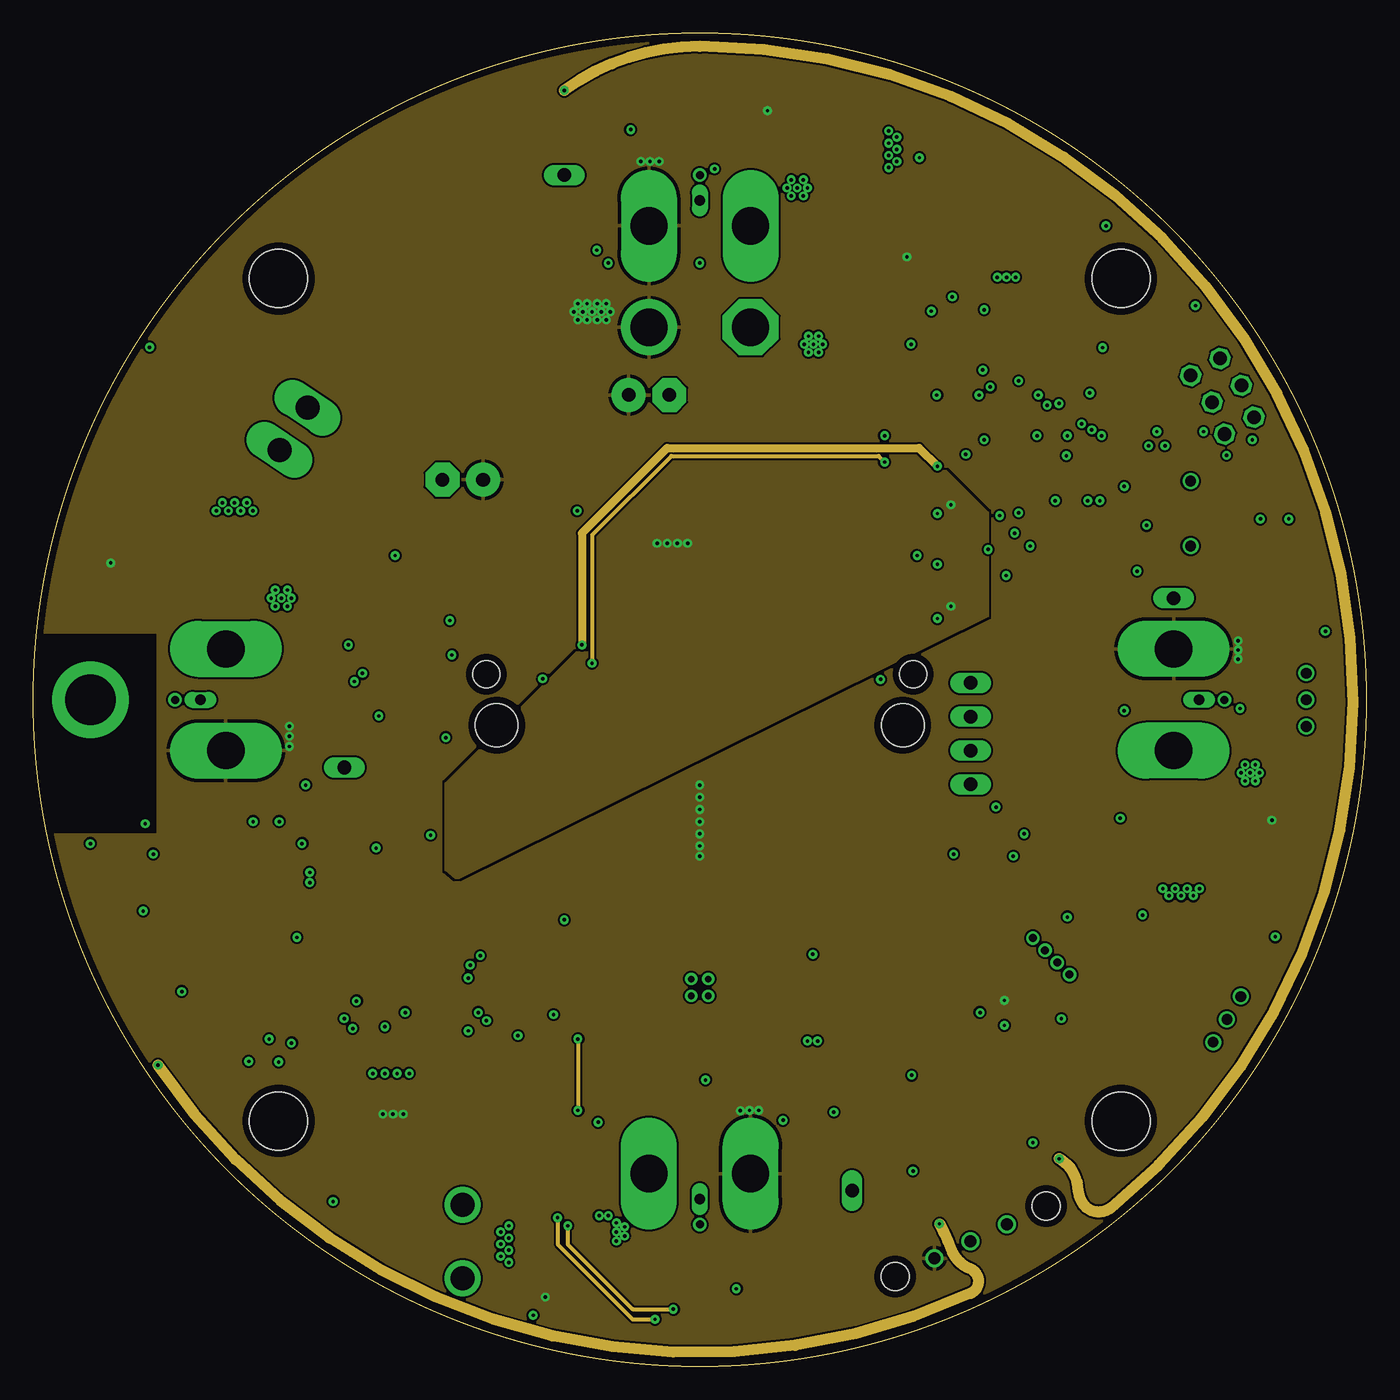
[diagram p8: board, inner layer Route2]
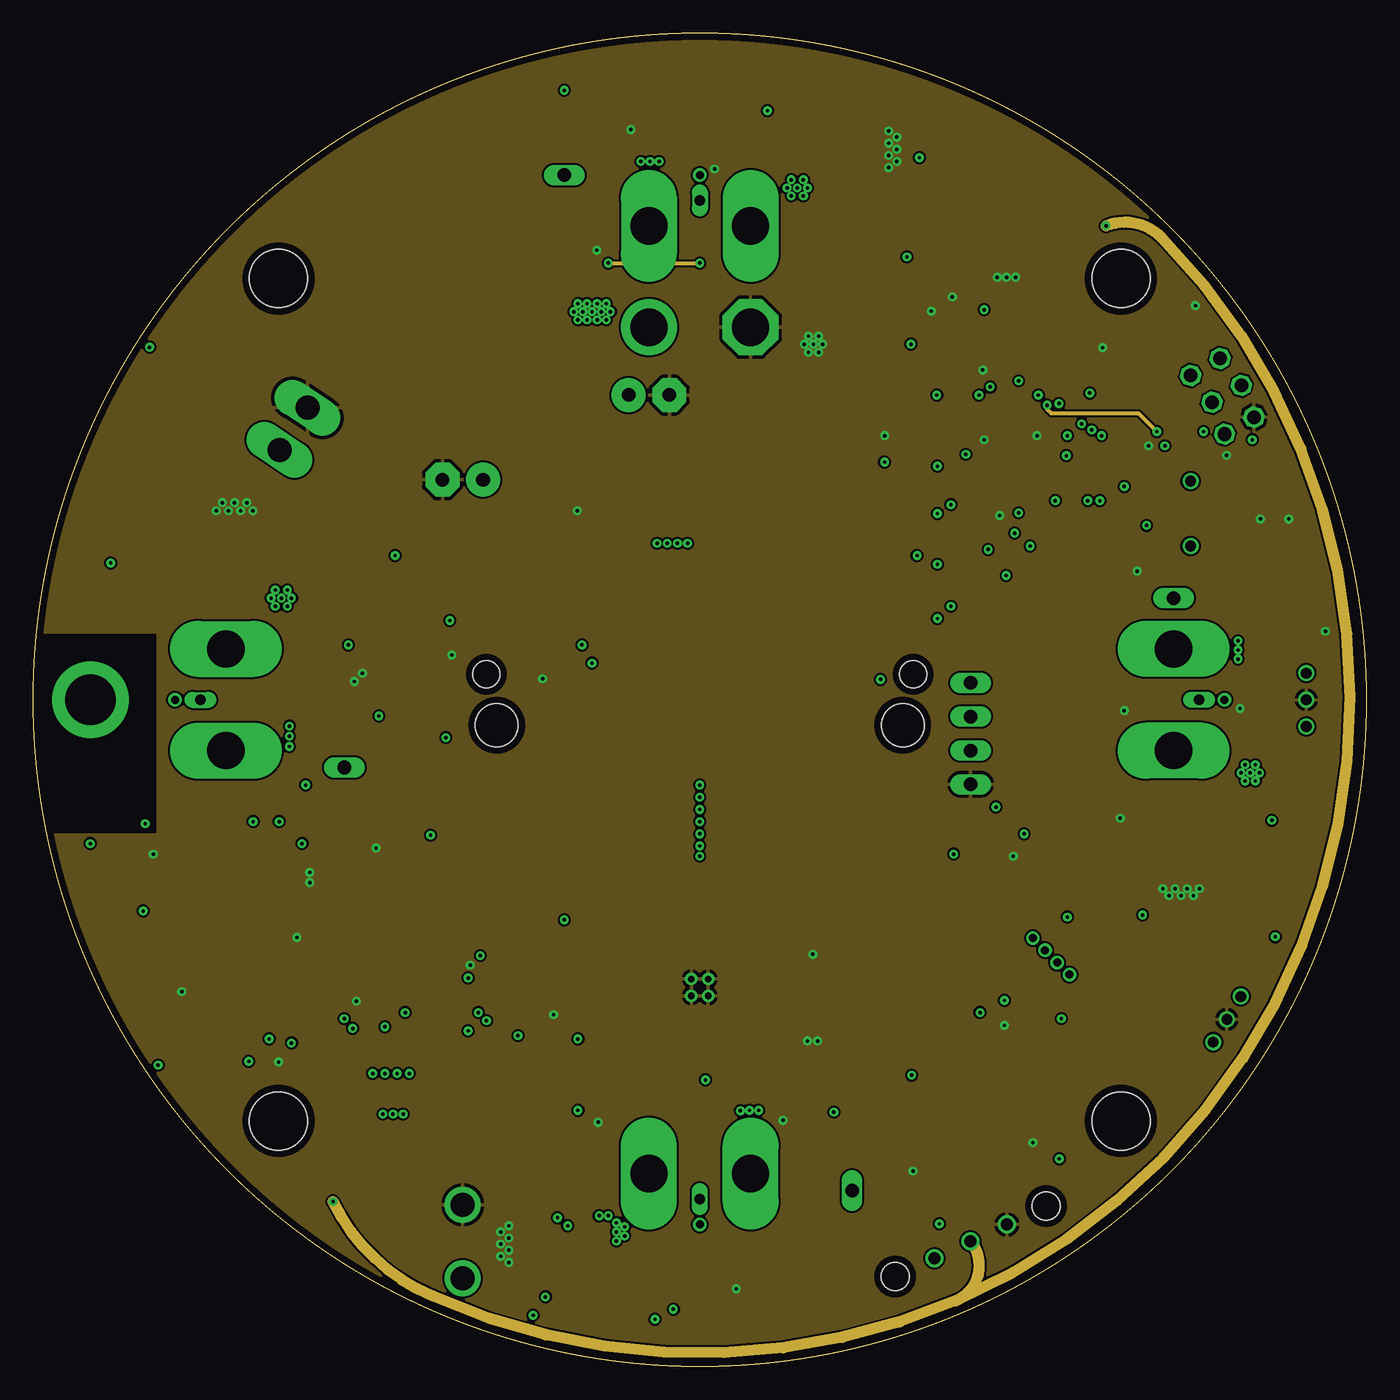
[diagram p9: board, inner layer Route15]
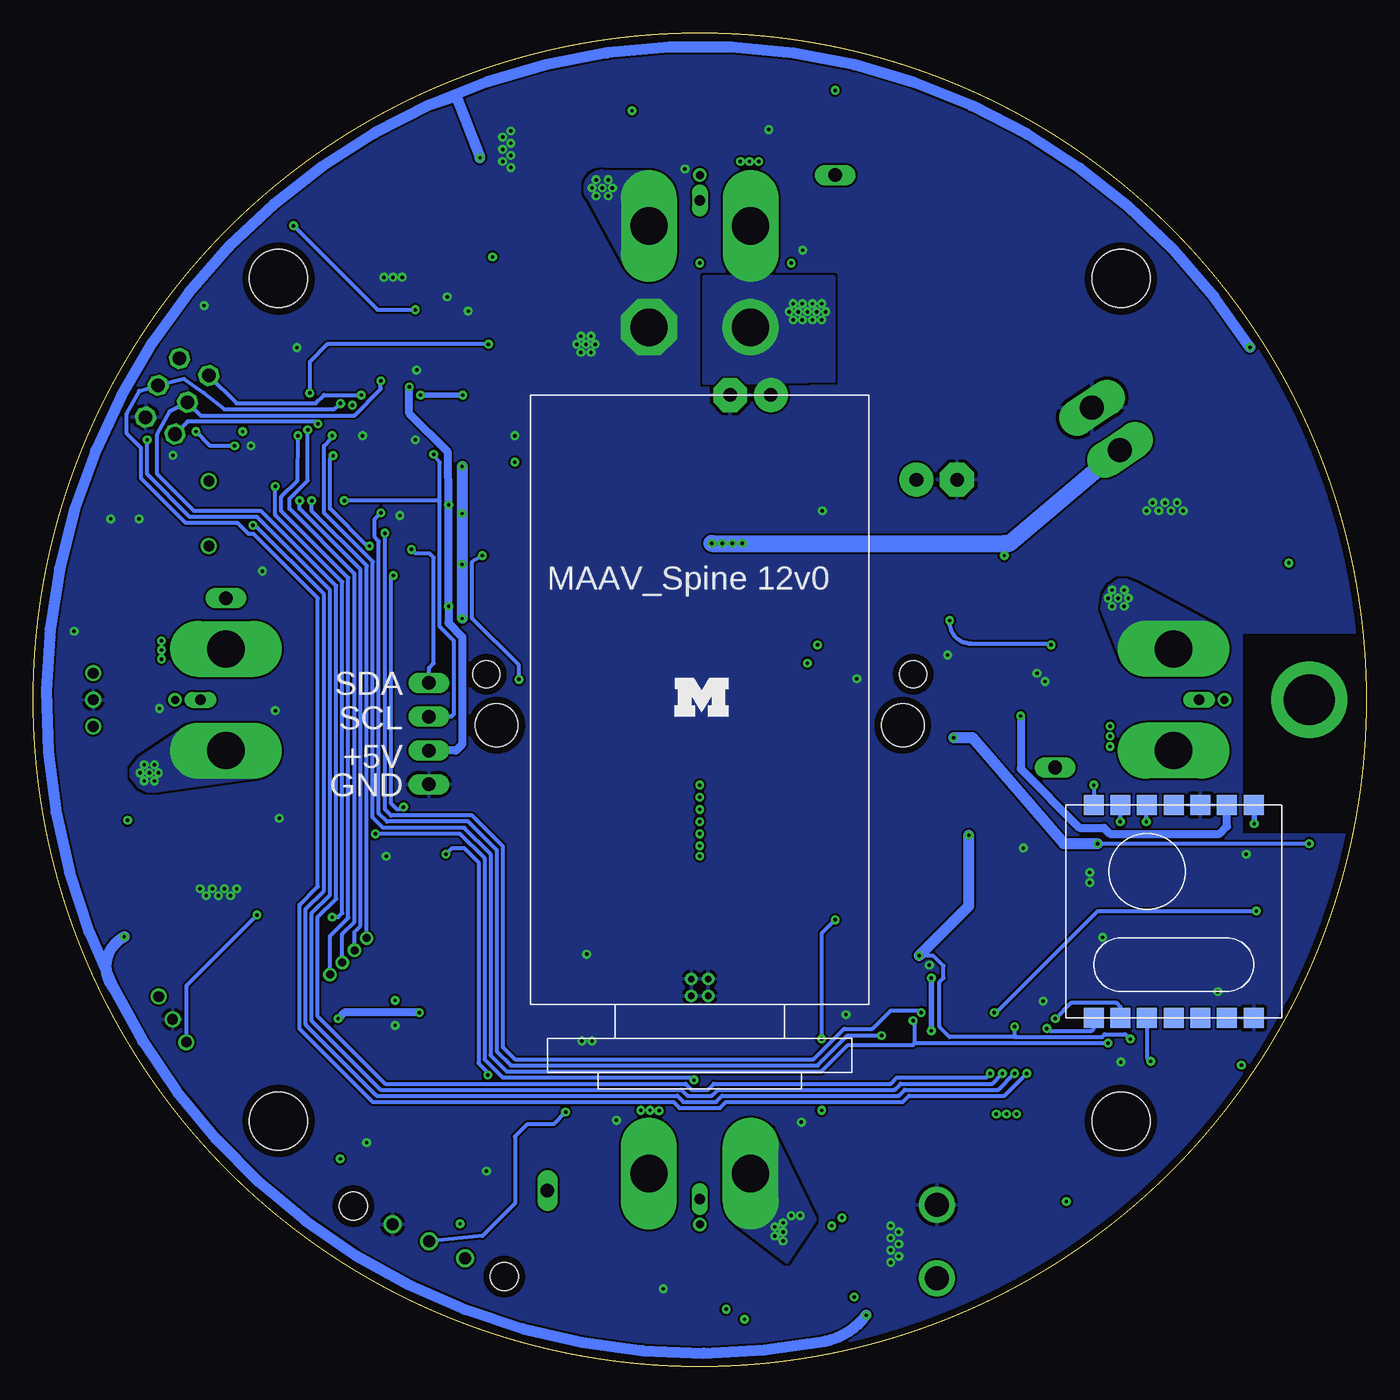
[diagram p10: board, bottom side, seen from below]

Size 100 x 100 mm. Coordinates in mm from the lower left corner, seen from the top.
Outline: circle at 50,50 radius 50
Copper layers (1+2*15+16): Top 0.0178mm / dielectric 12mil / Route2 0.0356mm / dielectric 28mil / Route15 0.0356mm / dielectric 12mil / Bottom 0.0178mm
Design rules: minimum track width 6mil, minimum drill 10mil, track to track 6mil, track to pad 6mil, pad to pad 6mil, via to via 6mil, smd to smd 6mil, copper to edge 20mil, drill to drill 16mil, minimum pad ring 8mil, minimum via ring 8mil, stop-mask expansion 3mil, vias tented up to drill 0mil, thermal gap 10mil
Holes 4.37 mm at 81.6,81.6 81.6,18.4 18.4,18.4 18.4,81.6

### Footprints (pad centres in the part's own frame; a part is rotated, then mirrored left to right if it is on the bottom)
0805 = smd 0.8 x 1.2: 1 -0.9,0; 2 0.9,0
2917 = smd 1.3 x 2.4: 1 -3,0; 2 3,0
C1210 = smd 1.6 x 2.7: 1 -1.4,0; 2 1.4,0
0603-CAP = smd 1.1 x 1: 1 -0.85,0; 2 0.85,0
EH22-9 = drill 1.016 pad 2.54: + 0,-1.524 | drill 1.016 pad 2.54 octagon: - 0,1.524
TRM-XXX-LT = smd 1.651 x 1.778: 1 -6.35,-7.747; 2 -3.81,-7.747; 3 -1.27,-7.747; 4 1.27,-7.747; 5 3.81,-7.747; 6 6.35,-7.747; 7 6.35,7.747; 8 3.81,7.747; 9 1.27,7.747; 10 -1.27,7.747; 11 -3.81,7.747; 12 -6.35,7.747
SO14 = smd 0.6 x 2.2: 1 -3.81,-2.6; 2 -2.54,-2.6; 3 -1.27,-2.6; 4 0,-2.6; 5 1.27,-2.6; 6 2.54,-2.6; 7 3.81,-2.6; 8 3.81,2.6; 9 2.54,2.6; 10 1.27,2.6; 11 0,2.6; 12 -1.27,2.6; 13 -2.54,2.6; 14 -3.81,2.6
PINTO_SMD = smd 2 x 1: P1 8.509,-36.83; P2 -11.811,-36.83; P3 11.811,-34.29; P4 -8.509,-34.29; P5 8.509,-31.75; P6 -11.811,-31.75; P7 11.811,-29.21; P8 -8.509,-29.21; P9 8.509,-26.67; P10 -11.811,-26.67; P11 11.811,-24.13; P12 -8.509,-24.13; P13 8.509,-21.59; P14 -11.811,-21.59; P15 11.811,-19.05; P16 -8.509,-19.05; P17 8.509,-16.51; P18 -11.811,-16.51; P19 11.811,-13.97; P20 -8.509,-13.97; P21 8.509,-11.43; P22 -11.811,-11.43; P23 11.811,-8.89; P24 -8.509,-8.89; P25 8.509,-6.35; P26 -11.811,-6.35; P27 11.811,-3.81; P28 -8.509,-3.81; P29 8.509,-1.27; P30 -11.811,-1.27; P31 11.811,1.27; P32 -8.509,1.27; P33 8.509,3.81; P34 -11.811,3.81; P35 11.811,6.35; P36 -8.509,6.35; P37 8.509,8.89; P38 -11.811,8.89; P39 11.811,11.43; P40 -8.509,11.43; P41 8.509,13.97; P42 -11.811,13.97; P43 11.811,16.51; P44 -8.509,16.51; P45 8.509,19.05; P46 -11.811,19.05; P47 11.811,21.59; P48 -8.509,21.59; P49 8.509,24.13; P50 -11.811,24.13; P51 11.811,26.67; P52 -8.509,26.67; P53 8.509,29.21; P54 -11.811,29.21; P55 11.811,31.75; P56 -8.509,31.75; P57 8.509,34.29; P58 -11.811,34.29; P59 11.811,36.83; P60 -8.509,36.83
MA03-2 = drill 1.016 octagon: P$1 -2.54,-1.46; P$2 0,-1.079; P$3 2.54,-1.46; P$4 2.54,1.079; P$5 0,1.46; P$6 -2.54,1.079
MOTOR_CONN_THRU = drill 2.8 long: +12V -3.81,0; GND 3.81,0 | drill 0.8 long: SIG 0,1.905
455-1751-1-ND = smd 3.5 x 1: 1 2.875,3; 2 2.875,1; 3 2.875,-1; 4 2.875,-3 | smd 3.4 x 1.5: P$1 -2.875,-5.35; P$2 -2.875,5.35
POWER_CONN = drill 1.8: P1 2.75,0; P2 -2.75,0
LED-0603 = smd 0.8 x 0.8: A 0,-0.75; C 0,0.75
CHIPLED_0805 = smd 1.2 x 1.2: A 0,-1.05; C 0,1.05
SOT-23 = smd 0.787 x 0.889: 1 0.025,-1.016; 2 -0.94,1.016; 3 0.991,1.016
CRYSTAL_16MHZ = drill 0.8: P$1 -2.44,0; P$2 2.44,0
SO-08 = smd 0.6 x 2.2: 1 -1.905,-2.6; 2 -0.635,-2.6; 3 0.635,-2.6; 4 1.905,-2.6; 5 1.905,2.6; 6 0.635,2.6; 7 -0.635,2.6; 8 -1.905,2.6
0603-RES = smd 1.1 x 1: 1 -0.85,0; 2 0.85,0
R0603 = smd 1 x 1.1: 1 -0.85,0; 2 0.85,0
SWITCH-ON-ON = drill 0.9: P$1 -3,0; P$2 0,0; P$3 3,0 | hole 2.1: -6.25,0; 6.25,0
SWITCH-OFF-MOM = smd 1.45 x 1: P$1 2.575,0.85; P$2 2.575,-0.85; P$3 -2.575,0.85; P$4 -2.575,-0.85
SJ_2S-NO = smd 0.635 x 1.27: 1 -0.45,0; 2 0.45,0
MA04-1 = drill 1.016 long: 1 -3.81,0; 2 -1.27,0; 3 1.27,0; 4 3.81,0
8-SOIC = smd 2 x 0.6: P$1 -2.4,1.905; P$2 -2.4,0.635; P$3 -2.4,-0.635; P$4 -2.4,-1.905; P$5 2.4,-1.905; P$6 2.4,-0.635; P$7 2.4,0.635; P$8 2.4,1.905
TPS5450 = smd 2.032 x 0.66: P$1 -2.794,1.905; P$2 -2.794,0.635; P$3 -2.794,-0.635; P$4 -2.794,-1.905; P$5 2.794,-1.905; P$6 2.794,-0.635; P$7 2.794,0.635; P$8 2.794,1.905 | smd 2.49 x 2.99: P$9 0,0 | drill 0.5: P$10 0.635,0.635; P$11 0.635,-0.635; P$12 -0.635,-0.635; P$13 -0.635,0.635
32-TQFP = smd 1.6 x 0.45: P$1 -4.1,2.8; P$2 -4.1,2; P$3 -4.1,1.2; P$4 -4.1,0.4; P$5 -4.1,-0.4; P$6 -4.1,-1.2; P$7 -4.1,-2; P$8 -4.1,-2.8; P$17 4.1,-2.8; P$18 4.1,-2; P$19 4.1,-1.2; P$20 4.1,-0.4; P$21 4.1,0.4; P$22 4.1,1.2; P$23 4.1,2; P$24 4.1,2.8 | smd 0.45 x 1.6: P$9 -2.8,-4.1; P$10 -2,-4.1; P$11 -1.2,-4.1; P$12 -0.4,-4.1; P$13 0.4,-4.1; P$14 1.2,-4.1; P$15 2,-4.1; P$16 2.8,-4.1; P$25 2.8,4.1; P$26 2,4.1; P$27 1.2,4.1; P$28 0.4,4.1; P$29 -0.4,4.1; P$30 -1.2,4.1; P$31 -2,4.1; P$32 -2.8,4.1
CDRH127 = smd 2.9 x 5.4: P1 -4.95,0; P2 4.95,0
DO-214AB,SMC = smd 2.5 x 3.3: P$1 -3.4,0; P$2 3.4,0
DO-214AC,SMA = smd 2 x 2: P$1 -2.1,0; P$2 2.1,0
IMU = hole 3.226: -15.24,-1.905; 15.24,-1.905 | hole 2.032: -16.002,1.905; 16.002,1.905
LIPO_POWER = drill 2.8 octagon: GND 3.81,0 | drill 2.8: V_BATT -3.81,0
MOTOR_SENSE = drill 1.016 long: SIGNAL 0,0
H3894-ND = drill 0.8: GND 0,-2.75; POW -2,-2.75; SIG 2,-2.75
POWER_HOLES = drill 1.8 long: P$1 -1.905,0; P$2 1.905,0
ANTENNA-418MHZ = drill 3.81: P$1 0,0
RF12 = smd 1.5 x 1.5: P$1 -8,6; P$2 -8,4; P$3 -8,2; P$4 -8,0; P$5 -8,-2; P$6 -8,-4; P$7 -8,-6; P$8 8,-6; P$9 8,-4; P$10 8,-2; P$11 8,0; P$12 8,2; P$13 8,4; P$14 8,6

### Placement (x,y rotation side)
C1  30.32,30.95 0 top
C2  54.57,56.35 180 top
C3  51.27,35.39 0 top
C4  53.81,51.27 0 top
C5  53.81,46.83 0 top
C6  44.92,27.14 90 top
C7  53.81,60.8 0 top
C8  31.59,51.35 90 top
C9  23.96,49.37 90 top
C10  74.94,79.21 90 top
C11  88.1,77.94 36.2 top
C12  70.32,70.32 270 top
C13  72.86,79.21 90 top
C14  90.64,65.88 90 top
C15  90.64,62.7 270 top
C16  53.81,65.24 0 top
C17  73.62,32.86 270 top
C18  73.62,36.03 90 top
C19  67.02,32.86 270 top
C20  67.02,36.03 90 top
C21  67.02,20.79 90 top
C22  67.02,16.98 270 top
C23  73.62,20.79 90 top
C24  73.62,16.98 270 top
C25  50,77.94 270 top
C26  53.81,70.32 180 top
C27  53.81,72.86 180 top
C28  46.19,72.86 270 top
C29  32.22,66.51 90 top
IC1  14.44,35.39 270 top
IC2  71.59,26.5 180 top
IC3  50,50 0 top
J1  89.37,72.86 300 top
J2  50,85.56 0 top
J3  50,14.44 180 top
J4  85.56,50 270 top
J5  14.44,50 90 top
J7  50,5.3 90 top
J9  32.22,9.36 270 top
LED1  75,90.38 330 top
LED2  73.24,91.4 330 top
LED3  71.48,92.42 330 top
MOTOR1  55.08,96.35 0 top
MOTOR2  95.09,41.11 270 top
MOTOR3  39.84,3.65 180 top
MOTOR4  3.65,60.16 90 top
MR1  70.32,79.21 180 top
Q1  86.83,63.97 90 top
Q2  26.38,14.31 180 top
R1  65.24,62.7 90 top
R2  70.32,62.7 90 top
R3  29.68,27.77 90 top
R4  29.68,23.96 90 top
R5  34.76,23.96 270 top
R6  34.76,27.77 90 top
R7  93.18,67.78 0 top
R8  66.51,81.75 180 top
R9  65.24,66.51 90 top
R10  70.32,66.51 270 top
R11  55.72,23.33 270 top
R12  55.72,26.5 90 top
R13  34.76,58.89 270 top
R14  29.68,58.89 270 top
R15  34.76,55.08 270 top
R16  29.68,55.08 90 top
R17  65.24,55.08 90 top
R18  70.32,55.08 90 top
R19  65.24,58.89 90 top
R20  70.32,58.89 270 top
R21  13.27,22.87 0 top
R22  55.72,33.49 270 top
R23  70.32,81.75 180 top
R24  52.54,96.35 90 top
R25  95.09,43.65 0 top
R26  42.38,3.65 270 top
R27  3.65,57.62 180 top
R28  71.59,32.86 270 top
R29  71.59,36.03 270 top
R30  69.05,32.86 270 top
R31  69.05,36.03 270 top
R32  69.05,20.79 90 top
R33  69.05,16.98 90 top
R34  71.59,20.79 90 top
R35  71.59,16.98 90 top
R44  73.1,87.08 240 top
R45  4.28,36.66 270 top
R46  27.14,29.68 270 top
R47  71.34,88.1 240 top
R48  69.58,89.12 240 top
R49  15.71,25.87 0 top
R50  19.52,25.87 0 top
R51  67.78,70.32 270 top
R52  65.24,70.32 90 top
R53  55.72,30.32 90 top
RECEIVE  11.9,24.6 90 top
S1  70.32,9.36 205 top
S2  93.18,62.7 90 top
SEND  11.9,25.87 90 top
SJ1  50,84.29 270 top
SJ2  84.29,50 180 top
SJ3  50,15.71 90 top
SJ4  15.71,50 0 top
SV1  70.32,47.46 90 top
T1  32.22,27.77 90 top
T2  32.22,23.96 90 top
T3  67.78,62.7 90 top
T4  67.78,66.51 90 top
T5  60.16,91.91 180 top
T6  86.83,39.84 90 top
T7  32.22,58.89 270 top
T8  32.22,55.08 270 top
T9  67.78,55.08 90 top
T10  67.78,58.89 90 top
T11  66.51,79.21 180 top
T12  39.84,8.5 0 top
T13  14.44,60.16 270 top
U2  50,28.41 90 top
U3  77.94,70.32 180 top
U4  27.77,49.37 270 top
U$1  30.95,38.57 90 top
U$2  50,40.48 180 top
U$3  50,91.91 180 top
U$4  91.91,50 90 top
U$5  50,20.79 0 top
U$6  20.79,50 270 top
U$7  50,50 0 bottom
U$8  50,77.94 0 top
U$9  39.84,89.37 0 top
U$10  91.91,24.6 238.9 top
U$11  23.33,44.92 0 top
U$12  19.52,70.32 56.3 top
U$13  4.28,50 90 top
U$14  61.43,13.17 270 top
U$15  85.56,57.62 0 top
U$16  98.26,50 270 top
U$17  14.44,34.12 90 bottom
U$18  [BLOCK-M]  51.91,48.73 0 bottom

### Tracks (layer width: path | path; a pad name or v marks a point on that pad's centre or on a via)
+1V8  (via drill 0.25)
  Top 0.305: 66.79,67.53 T4.3
  Top 0.61: R13.2 34.62,57.9 T7.3 32.5,57.9 32.22,57.62 32.22,54.45 32.58,54.09 T8.3 34.62,54.09 R15.2 36.24,54.23 36.66,53.81 IC3.P34 41.01,53.81 v41.16,54.12
  Top 0.813: v67.83,67.53 66.79,67.53 | v67.83,56.1 66.79,56.1 T9.3 65.38,56.07 R17.2 | v67.83,60.16 67.55,59.88 T10.3 65.38,59.88 R19.2 | v67.83,63.97 67.04,63.97 T3.3 65.38,63.69 R1.2 | T4.3 65.38,67.5 R9.2
  Route2 0.61: v41.16,54.12 41.16,62.5 47.56,68.9 66.46,68.9 v67.83,67.53
  Bottom 0.813: v67.83,56.1 v67.83,60.16 v67.83,63.97 v67.83,67.53
+5V  (via drill 0.25)
  Top 0.305: v33.54,30.8 34.76,29.58 R6.2 | R14.2 27.99,58.04 27.14,58.89 v27.14,60.82 | IC2.9 69.05,23.18 70.32,21.91 70.32,19.94 | U3.P$6 83.19,71.52 83.68,71.03 83.68,70.42 | 83.68,70.42 83.18,69.92 U3.P$4 | R11.2 40.26,22.48 39.64,21.86 | J7.1 47,3.87 v46.65,3.52 | v39.33,11.14 39.64,11.44 39.64,21.86 | 72.4,73.47 72.4,72.56 72.64,72.32 U3.P$18 74.92,72.32 75.15,72.1 v76.06,72.1 | 72.4,73.47 72.4,76.97 72.86,77.43 C13.1 | v84.29,70.12 83.98,70.42 83.68,70.42 | v71.79,73.47 72.4,73.47 | 80.17,39.48 80.02,39.33 | v26.38,25.46 26.68,25.46 27.6,24.55 27.6,23.48 28.97,22.11 34.76,22.11 R5.2 36.27,23.11 37.53,21.86 39.64,21.86 | v17.69,24.55 17.64,24.6 RECEIVE.A 12.65,23.93 12.42,23.7 R21.1
  Top 0.61: R14.2 R16.2 | R20.2 R18.2 | R2.2 R10.2 70.32,64.63 v68.85,64.63 | R20.2 69.62,58.04 68.9,57.31 v68.85,57.01 | 84.56,33.76 80.17,38.15 80.17,39.48 80.17,57.01 79.15,58.04 R20.2 | 84.56,33.76 U$10.POW | C26.2 C27.2 | C13.1 C10.1 | R34.1 70.32,19.94 R32.1 | 70.32,33.7 R30.1 | 70.32,33.7 R28.1 | 70.32,33.7 IC2.5 70.32,26.58 70.27,26.53 | 70.27,26.53 69.05,26.53 | 69.05,26.53 69.05,23.18 | IC2.7 67.78,27.04 68.29,26.53 69.05,26.53 | IC2.11 71.59,25.97 v71.03,26.53 70.27,26.53 | v77.13,26.07 77.13,26.33 84.56,33.76 | v25.92,48.78 25.66,48.52 C9.1
  Top 0.813: C11.1 J1.P$6 92.37,74.69 94.03,71.5 R7.2 94.86,67.78 95.41,67.22 95.41,52.09 U$16.POW arc-100 99.02,50 arc-23 94.96,30.46 arc-61 U$10.POW
  Top 1.016: U4.P$6 27.14,43.65 28.41,42.38 v29.81,39.84 U$1.P2
  Top 1.27: IC3.P48 41.49,69.94 43.65,67.78 43.65,64.88 v46.8,61.73 | C26.2 52.41,69.77 C16.1
  Route2 0.305: v39.33,11.14 39.33,9.16 44.97,3.52 v46.65,3.52
  Route15 0.305: v76.06,72.1 76.06,71.79 76.36,71.49 82.92,71.49 v84.29,70.12
  Bottom 0.305: v33.54,30.8 32.47,30.8 31.71,30.04 31.71,29.12 32.02,28.82 32.02,25.46 31.25,24.7 26.38,24.7 | 27.14,61.73 v27.14,60.82 | v17.69,24.55 18.07,24.91 19.62,24.91 19.82,24.7 26.38,24.7 | v26.38,25.46 26.38,24.7
  Bottom 0.61: v71.79,73.47 71.79,71.47 68.9,68.58 v68.85,64.63 v68.85,57.01 68.85,55.77 67.83,54.72 67.83,46.65 68.29,46.19 SV1.2 | v71.03,26.53 76.67,26.53 v77.13,26.07 | U$17.P$9 10.44,40.49 10.99,39.94 19.21,39.94 19.67,40.4 21.5,40.4 25.92,44.82 v25.92,48.78
  Bottom 0.813: v29.81,39.84 29.81,34.53 v33.54,30.8
  Bottom 1.27: U$12.P$1 26.77,61.73 27.14,61.73 v49.09,61.73
  other vias: 47.56,61.73 48.32,61.73
  pour Top (no thermals): 23.33,48.73 23.33,48.09 25.23,46.19 27.14,46.19 27.14,48.09 25.87,49.37 23.96,49.37
  pour Top (rank 3, no thermals): 52.39,70.78 52.44,59.6 52.9,54.72 50,54.72 47.66,42.38 36.13,41.01 27.14,35.22 27.14,43.65 42.38,51.27 42.23,71.95 46.39,70.02 49.85,69.96
  pour Route2: 41.11,62.7 41.11,53.81 30.95,43.65 30.95,37.3 31.76,36.64 71.59,56.35 71.59,63.97 66.51,69.05 47.46,69.05
+12V  (via drill 0.25)
  Top 0.305: R8.2 65.61,83.16 v65.55,83.22 | IC2.3 v72.86,27.45 | MOTOR3.A 38.92,4.7 v38.42,5.19
  Top 0.61: MOTOR4.A 5.7,60.16 v5.8,60.26 | MOTOR1.A v55.08,94.2 | MOTOR2.A 93.08,41.11 v92.93,40.96
  Top 2.54: U$5.P$2 53.81,19.08 J3.+12V | U$4.P$2 90.2,53.81 J4.+12V | U$3.P$2 46.19,90.2 J2.+12V | U$6.P$2 J5.+12V
  other vias: 50,41.77 50,40.86 50,42.68 50,39.94 50,38.27 50,39.03 50,43.6 40.86,79.72 40.55,79.11 41.54,79.72 42.3,79.72 42.99,79.72 43.29,79.11 42.61,79.11 41.92,79.11 41.24,79.11 40.86,78.5 41.54,78.5 42.3,78.5 42.99,78.5 54.42,19.19 53.73,19.19 53.05,19.16 90.39,54.42 90.39,53.73 90.39,53.05 46.95,90.39 46.27,90.39 45.58,90.39 19.22,46.49 19.22,47.26 19.22,48.02 27.75,18.91 26.99,18.91 26.23,18.91
  pour Top (rank 2, no thermals): 47.82,42.18 50.28,54.34 52.95,54.42 50.05,32.22 50.3,29.73 49.37,29.68 48.53,30.19
  pour Route2 (rank 4): 29.68,100.8 -0.8,71.59 -0.8,55.08 9.36,55.08 9.36,39.84 -0.8,39.84 -0.8,28.41 29.68,-0.8 71.59,-0.8 100.8,28.41 100.8,71.59 71.59,100.8
  pour Top (no thermals): 49.7,73.77 39.94,73.77 39.94,81.7 49.7,81.7
  pour Bottom (no thermals): 49.7,81.7 49.7,73.77 39.94,73.93 39.94,81.7
  pour Top (no thermals): 29.58,15.86 29.58,18.15 27.9,19.82 26.38,19.82 25.16,18.76 25.16,15.25 28.97,15.25
ANTENNA  (via drill 0.25)
  Top 0.406: U$13.P$1 4.28,42.38 4.91,41.74 IC1.1 7.35,41.74 v8.4,40.7
  Bottom 0.406: U$17.P$8 8.4,42.08 v8.4,40.7
BATT_SENSE  (via drill 0.25)
  Top 0.406: U3.P$19 72.3,71.52 v70.95,72.86 | R52.2 66.93,72.86 v67.78,72.86 R51.1
  Bottom 0.406: v67.78,72.86 v70.95,72.86
DATA_3V
  Top 0.305: R4.1 28.73,23.11 28.05,23.79 28.05,24.85 23.86,29.05 IC1.7
  Top 0.813: T2.2 31.11,23.11 R4.1
DATA_5V  (via drill 0.25)
  Top 0.305: 35.1,25.16 R5.1 36.32,24.82 v36.36,24.8 | v73.93,64.02 73.84,64.11 U3.P$24
  Top 0.406: R5.1 34.06,24.82 T2.1
  Bottom 0.305: v73.93,64.02 74.38,63.56 74.38,62.19 74.08,61.89 74.08,41.47 73.47,40.86 67.37,40.86 65.24,38.72 65.24,23.64 64.17,22.57 41.16,22.57 38.93,24.8 v36.36,24.8
ENABLE  (via drill 0.25)
  Top 0.305: R51.2 69.05,70.74 69.05,75.3 71.26,77.51 MR1.2 71.26,79.19 v71.34,79.26 | v60.06,19.06 60.06,34.15 59.6,34.61 55.93,34.61 R22.1
  Top 0.61: v22.49,12.36 24.47,14.34 Q2.4
  Route15 0.813: 69.19,4.89 arc-47 30,5.24 arc-42 v22.49,12.36 | S1.P$2 arc-106 69.19,4.89 | 69.19,4.89 arc111 84.66,84.66 arc67 v80.48,85.56
  Bottom 0.305: v80.48,85.56 74.18,79.26 v71.34,79.26 | S1.P$2 66.31,9.77 63.87,12.2 63.87,17.23 62.95,18.15 60.97,18.15 v60.06,19.06
GND  (via drill 0.25)
  Top 0.305: C14.1 C15.1 90.65,63.56 v92.06,63.56 | S2.P$2 94.03,63.73 v94.2,63.56 94.03,63.4 S2.P$4 | v83.68,69.05 83.61,69.12 U3.P$3 81.02,69.12 80.78,69.36 80.78,70.42 81.08,70.72 U3.P$5 | U3.P$21 75.19,69.92 v75.3,69.81 | C11.2 87.66,79.57 v87.19,79.57 | C12.2 70.36,69.51 v71.34,69.51 | R52.1 64.06,69.47 v63.87,69.81 | v74.99,16.78 74.99,16.47 74.54,16.02 73.47,16.02 | 73.47,36.89 73.47,38.27
  Top 0.61: C22.2 67.14,15.33 66.46,14.64 v66,14.64 | v72.86,25.57 IC2.12
  Top 0.813: U2.P$11 U2.P$6 | U2.P$11 U2.P$9 U2.P$13 U2.P$10 | 50.63,28.41 U2.P$11 | 50.63,28.41 U2.P$12 | R53.1 R12.2 55.72,28.41 50.63,28.41 | IC1.2 8.22,39.2 v9,38.42 | v20.74,37.05 v20.74,36.28 20.74,36.66 IC1.10 | J7.4 53,6.06 v52.74,5.8 | SEND.C 11.15,26.82 v11.14,28.11 | C1.2 32.02,30.95 v32.78,30.09 | T11.2 67.45,79.03 v67.37,79.16 | C8.2 31.59,53.17 v31.41,53.35
  Top 2.54: 57.62,41.11 IC3.P23
  other vias: 35.67,10.53 35.06,10.07 35.67,9.61 35.06,9.16 35.67,8.7 35.06,8.24 35.67,7.79 14.19,64.78 15.1,64.78 16.01,64.78 16.47,64.17 15.56,64.17 14.64,64.17 13.73,64.17 84.75,35.83 85.2,35.29 85.66,35.83 86.12,35.29 86.58,35.83 87.03,35.29 64.17,89.93 64.78,90.39 64.17,90.84 64.78,91.3 64.17,91.76 64.78,92.21 64.17,92.67 58.15,77.28 58.92,77.28 59.22,76.67 58.53,76.67 57.85,76.67 58.15,76.06 58.92,76.06 87.49,35.83 72.33,81.7 73.01,81.7 73.7,81.7 24.09,51.37 24.7,51.98 58.84,24.4 58.08,24.4 38.21,51.57 25.72,38.87 39.03,26.38 42.38,18.3 56.25,18.45 82.82,59.65 81.85,49.19 90.54,49.34 72.5,63.82 44.82,92.77 42.28,83.73 51.12,89.83 71.23,74.74 68.95,80.23 81.55,41.11 73.52,38.27 19.77,32.17 18.4,22.82 40.81,64.17 80.23,76.42 89.52,68.34 24.24,27.39 96.94,55.13 58.48,30.9
  pour Route15 (rank 5): -0.8,71.59 29.68,100.8 71.59,100.8 100.8,71.59 100.8,28.41 71.59,-0.8 29.68,-0.8 -0.8,28.41 -0.8,39.84 9.36,39.84 9.36,55.08 -0.8,55.08
  pour Top (rank 5, no thermals): 50.3,81.7 50.3,34.4 60.06,34.4 60.06,81.7
  pour Bottom (no thermals): 50.3,81.7 50.3,73.77 60.06,73.77 60.06,81.7
  pour Top (no thermals): 23.63,49.85 26.84,49.85 27.29,50.3 27.29,51.98 26.84,52.44 24.4,52.44 24.09,52.13 23.63,51.68
  pour Top (no thermals): 59.3,23.48 58.84,24.4 58.08,24.4 57.77,23.48
  pour Top (no thermals): 75.3,79.72 72.56,79.72 71.03,81.24 71.03,82.16 73.93,82.16 75.3,80.48
  pour Top (no thermals): 38.27,7.63 35.67,7.18 34.61,7.94 34.61,10.22 35.67,11.14 38.27,10.53
  pour Top (no thermals): 88.1,39.64 84.44,39.64 83.99,39.18 83.99,35.83 84.9,34.91 87.34,34.91 88.56,36.13 88.56,39.18
  pour Top (no thermals): 17.23,60.36 17.69,60.82 17.69,63.87 16.01,65.54 14.34,65.54 13.12,64.33 13.12,60.82 13.58,60.36
  pour Top (no thermals): 61.73,89.78 62.19,89.32 64.63,89.32 65.39,90.08 65.39,92.06 65.39,92.52 64.63,93.28 62.34,93.28 61.73,92.67
  pour Top (rank 6): 29.68,100.8 71.59,100.8 100.8,71.59 100.8,28.41 71.59,-0.8 29.68,-0.8 -0.8,28.41 -0.8,39.84 9.36,39.84 9.36,55.08 -0.8,55.08 -0.8,71.59
  pour Bottom (rank 6): 29.68,100.8 71.59,100.8 100.8,71.59 100.8,28.41 71.59,-0.8 29.68,-0.8 -0.8,28.41 -0.8,39.84 9.36,39.84 9.36,55.08 -0.8,55.08 -0.8,71.59
INT0  (via drill 0.25)
  Top 0.305: v23.33,26.07 23.33,25.01 23.79,24.55 24.24,24.55 26.38,22.42 v26.38,21.96 | U3.P$32 80.74,65.28 82.94,63.08 v83.53,63.08
  Bottom 0.305: U$17.P$2 18.44,26.97 18.76,27.29 22.11,27.29 v23.33,26.07 | v26.38,21.96 27.6,20.74 34.61,20.74 35.06,20.28 48.32,20.28 48.78,19.82 51.22,19.82 51.68,20.28 74.23,20.28 79.57,25.62 79.57,34.3 78.19,35.67 78.19,57.92 83.35,63.08 v83.53,63.08
LED1
  Top 0.305: R48.2 arc51 68.44,86.88 68.44,86.27 71.49,83.22 74.23,83.22 77.54,79.91 U3.P$13
LED2
  Top 0.305: U3.P$12 78.34,79.88 74.54,83.68 71.79,83.68 70.12,85.36 70.12,85.81 arc-54 R47.2
LED3  (via drill 0.25)
  Top 0.305: U3.P$2 84.17,68.32 v84.9,69.05 | v87.8,70.12 78.8,79.11 78.8,80.17 74.84,84.14 72.4,84.14 72.1,84.44 72.1,85.05 arc-48 R44.2
  Bottom 0.305: v84.9,69.05 86.73,69.05 v87.8,70.12
MISO  (via drill 0.25, 0.25 pad 0.61)
  Top 0.305: U3.P$16 75.14,73.12 v75.4,72.86 | v91.45,69.51 90.69,70.12 89.93,71.34 89.93,72.25 88.71,74.08 J1.P$1 | 24.24,25.31 v23.96,25.34 24.22,25.34 27.29,22.26 v27.29,21.96
  Bottom 0.305: v75.4,72.86 78.19,72.86 78.8,72.25 84.76,72.25 J1.P$1 | v91.45,69.51 91.45,66.92 88.25,63.72 83.22,63.72 77.74,58.23 77.74,35.37 79.11,34 79.11,25.92 73.93,20.74 51.37,20.74 50.91,20.28 49.09,20.28 48.63,20.74 35.37,20.74 34.91,21.2 28.05,21.2 v27.29,21.96 | 20.59,25.98 U$17.P$1 20.44,25.32 20.43,25.31 20.59,25.16 23.79,25.16 v23.96,25.34
MOSI  (via drill 0.25)
  Top 0.305: U3.P$15 75.94,73.28 v76.95,72.22 | v16.5,40.86 16.93,40.4 16.93,31.25 22.87,25.31 22.87,24.7 23.48,24.09 23.94,24.09 25.46,22.57 v25.46,21.96
  Bottom 0.305: U$17.P$12 16.47,42.09 v16.5,40.86 | v76.95,72.22 77.43,71.79 85.66,71.79 87.19,73.01 88.71,74.08 J1.P$5 92.06,73.16 92.98,71.49 92.98,69.96 91.91,68.9 91.91,66.61 88.56,63.26 84.67,63.26 83.86,62.45 83.48,62.45 78.65,57.62 78.65,35.98 80.02,34.61 80.02,25.31 74.54,19.82 51.98,19.82 51.52,19.37 48.48,19.37 48.02,19.82 34.76,19.82 34.3,20.28 27.14,20.28 v25.46,21.96
MOTOR1_NEG  (via drill 0.25)
  Top 0.61: R24.1 52.54,92.35 U$3.P$1
  other vias: 56.55,88.4 57.32,88.4 57.77,87.8 56.86,87.8 57.77,89.01 56.86,89.01 58.08,88.4
  pour Bottom (no thermals): 55.49,82.46 58.23,87.49 arc147 57.16,89.62 53.66,89.62
  pour Top (no thermals): 52.9,92.67 56.86,93.89 59.3,93.89 59.91,93.28 59.91,89.93 55.49,82.46 51.22,91
MOTOR1_PWM_1V8
  Top 0.61: T7.2 34.67,59.83 R13.1 35.81,59.74 36.66,58.89 IC3.P38
MOTOR1_PWM_5V  (via drill 0.25)
  Top 0.305: R14.1 29.68,60.47 30.34,61.12 35.83,61.12 36.28,61.58 36.28,81.7 37.35,82.77 v43.14,82.77 | v50,82.77 SJ1.2
  Top 0.61: R14.1 30.33,59.74 T7.1
  Route15 0.305: v43.14,82.77 v50,82.77
MOTOR1_RPM  (via drill 0.25, 0.6)
  Top 0.305: IC2.13 74.13,25.87 76.06,27.8 76.06,29.53 v76.82,30.29 | U3.P$10 79.94,72.78 79.41,72.25 v79.41,70.24
  Bottom 0.305: v76.82,30.29 76.82,32.42 75.91,33.34 75.91,59.45 80.78,64.33 80.78,65.09 79.41,66.46 v79.41,70.24
MOTOR1_SENSE  (via drill 0.25)
  Top 0.305: v72.99,59.32 73.16,59.14 79.72,59.14 81.24,57.62 U$15.SIGNAL | R29.1 71.59,41.26 v72.22,41.95
  Bottom 0.305: v72.99,59.32 73.16,59.14 73.16,42.23 72.71,41.77 72.4,41.77 v72.22,41.95
MOTOR2_NEG  (via drill 0.25)
  Top 0.61: R27.1 12.4,57.62 T13.P$5
  other vias: 19.37,57.62 18.61,57.62 17.84,57.62 18.15,58.23 19.06,58.23 18.15,57.01 19.06,57.01
  pour Bottom (no thermals): 18.3,52.9 19.82,56.86 19.67,57.77 19.22,58.53 18.61,58.99 18,58.99 17.23,58.69 11.29,55.49
  pour Top (no thermals): 21.65,53.05 19.98,57.62 19.52,58.38 18.91,58.99 18.15,59.14 17.23,59.3 12.81,59.3 8.85,60.52 7.94,59.75 10.53,53.05 19.82,51.22
MOTOR2_PWM_1V8
  Top 0.61: T8.2 34.67,56.02 R15.1 36.24,55.93 36.66,56.35 IC3.P36
MOTOR2_PWM_5V  (via drill 0.25)
  Top 0.305: v23.64,54.12 22.87,53.35 22.87,50.91 21.96,50 SJ4.2 | v31.25,55.94 31.25,55.11 T8.1
  Top 0.61: R16.1 30.38,54.23 T8.1
  Bottom 0.305: v23.64,54.12 23.75,54.23 R16.1 arc95 v31.25,55.94
MOTOR2_RPM  (via drill 0.25, 0.6)
  Top 0.305: IC2.14 75.4,25.87 76.67,27.14 76.67,28.31 v77.74,29.38 | U3.P$9 80.74,72.81 79.87,71.95 79.87,70.73 80.17,70.42 v80.15,69.81
  Bottom 0.305: v77.74,29.38 77.74,32.27 76.36,33.64 76.36,59.14 81.39,64.17 81.39,65.24 80.17,66.46 v80.15,69.81
MOTOR2_SENSE  (via drill 0.25)
  Top 0.305: R31.1 v69.05,38.42 | v65.9,21.83 65.24,21.2 65.24,14.44 63.97,13.17 U$14.SIGNAL
  Bottom 0.305: v69.05,38.42 68.59,38.88 67.68,38.88 66.61,37.81 66.61,22.72 65.85,21.96 v65.9,21.83
MOTOR3_NEG  (via drill 0.25)
  Top 0.305: R26.1 42.38,6.45 T12.P$5
  other vias: 43.75,9.39 44.36,9.77 43.75,10.07 42.46,11.29 43.75,10.76 44.36,10.45 43.14,11.29
  pour Bottom (no thermals): 43.45,7.79 47.26,10.68 44.67,17.84 41.31,10.99
  pour Top (no thermals): 48.63,19.98 47.87,11.29 43.6,6.11 43.14,5.65 40.86,5.65 40.09,6.41 40.09,9.31 42.38,16.93 43.14,17.84 46.95,21.65
MOTOR3_PWM_1V8
  Top 0.305: R17.1 64.52,54.23 64.17,54.57 64.17,55.49 63.31,56.35 IC3.P35
  Top 0.813: T9.2 65.33,54.14 R17.1
MOTOR3_PWM_5V  (via drill 0.25)
  Top 0.305: 70.36,54.27 R18.1 70.99,54.23 71.34,54.57 71.34,56.86 71.79,57.31 78.96,57.31 79.57,56.71 79.57,40.7 78.8,39.94 v74.33,39.94 | v50.43,21.48 50.46,21.25 50,20.79 SJ3.2
  Top 0.813: T9.1 69.67,54.23 R18.1
  Bottom 0.305: v74.33,39.94 67.98,39.94 66.15,38.11 66.15,23.02 64.78,21.65 50.61,21.65 v50.43,21.48
MOTOR3_RPM  (via drill 0.25, 0.6)
  Top 0.305: IC2.1 75.4,30.7 v75.91,31.2 | v80.02,64.94 79.94,65.02 U3.P$31
  Bottom 0.305: v75.91,31.2 75.91,32.58 75.45,33.03 75.45,59.75 80.02,64.33 v80.02,64.94
MOTOR3_SENSE  (via drill 0.25)
  Top 0.813: U$11.SIGNAL 19.52,44.92 17.59,42.99 15.71,42.99 9.36,36.64 v9.36,22.59 | v67.98,10.68 69.05,11.75 R33.1
  Route2 0.813: v67.98,10.68 arc-7 68.9,8.7 arc47 70.27,7.33 arc-134 70.32,5.46 arc-81 v9.36,22.59
MOTOR4_NEG  (via drill 0.25)
  Top 0.61: R25.1 91.86,43.65 v91.68,43.9
  Top 0.813: v91.68,43.9 91.69,43.81
  other vias: 90.92,45.12 91.68,45.12 91.3,44.51 90.61,44.51 91.99,44.51 90.92,43.9
  pour Bottom (no thermals): 88.4,48.02 92.06,45.58 92.67,44.82 92.67,44.21 92.06,43.45 91.45,43.14 90.69,43.14 83.22,44.21
  pour Top (no thermals): 89.32,40.55 92.67,44.06 92.67,47.1 91,48.78 83.38,48.17 81.7,45.28 84.44,40.55
MOTOR4_PWM_1V8
  Top 0.305: R19.1 64.52,58.04 63.66,58.89 IC3.P37
  Top 0.813: T10.2 65.33,57.95 R19.1
MOTOR4_PWM_5V
  Top 0.305: R20.1 71.05,59.74 72.1,58.69 79.41,58.69 80.78,57.31 80.78,50.97 81.75,50 SJ2.2
  Top 0.813: T10.1 69.62,59.74 R20.1
MOTOR4_RPM  (via drill 0.25, 0.6)
  Top 0.305: IC2.2 74.13,30.49 74.99,31.36 v74.99,32.12 | v79.11,64.94 79.14,65.12 U3.P$30
  Bottom 0.305: v79.11,64.94 79.11,64.17 74.99,60.06 v74.99,32.12
MOTOR4_SENSE  (via drill 0.25)
  Top 0.305: R35.1 71.59,15.15 72.1,14.64 76.06,14.64 v76.97,15.56
  Top 0.813: v39.84,95.72 U$9.SIGNAL
  Route2 0.813: v39.84,95.72 arc-36 50,99.02 arc-141 80.85,11.9 arc-102 78.65,12.36 arc-23 78.35,13.42 arc57 v76.97,15.56
MOTOR_ENABLE  (via drill 0.25, 0.25 pad 0.25)
  Top 0.305: v66.48,90.66 66.48,93.1 65.77,93.81 T5.P$4
  Top 0.61: MR1.1 70.3,80.88 R23.2
  Top 0.813: R23.2 69.42,82.65 66.51,85.56 66.51,90.64 v66.48,90.66 | v37.5,3.82 37.44,3.89 T12.P$4 | v93.18,32.22 93.18,34.76 90.5,37.44 T6.P$4 | T13.P$4 8.73,66.37 v8.73,76.45
  Bottom 0.813: v8.73,76.45 arc-82 70.32,94.61 | 70.32,94.61 arc-92 94.01,28.41 | 94.01,28.41 arc-75 40.6,1.89 arc-42 v37.5,3.82 | 94.01,28.41 arc99 v93.18,32.22 | v66.48,90.66 68.29,95.26 70.32,94.61
MOTOR_LOGIC  (via drill 0.25)
  Top 0.305: T11.3 65.52,77 v65.85,76.67 | U3.P$11 79.14,73.13 v79.26,73.01
  Bottom 0.305: v79.26,73.01 79.26,75.35 77.94,76.67 v65.85,76.67
N$2
  Top 0.305: R44.1 LED1.A
N$3
  Top 0.406: U3.P$20 70.77,70.72 C12.1
N$4
  Top 0.813: U2.P$4 51.91,25.66 R12.1 R11.1
N$5
  Top 0.305: 67.41,80.23 R8.1 | T11.1 67.41,80.23 | MR1.3 69.33,78.31 67.41,80.23
N$6
  Top 0.305: U3.P$8 84.03,73.12 86.83,70.32 Q1.P$2 90.33,66.41 C14.2
N$7
  Top 0.61: R31.2 C20.1 C19.1
N$8
  Top 0.305: U3.P$7 83.56,72.32 85.56,70.32 85.56,62.8 Q1.P$1 90.32,61.53 C15.2
N$9
  pour Top (no thermals): 44.92,25.87 45.43,26.84 48.02,26.84 48.32,26.53 48.32,24.85 48.02,24.4 45.12,24.4 44.92,24.6
N$10
  Top 0.254: 20.37,23.88 20.37,21.64 20.16,21.43 11.9,21.43 11.15,22.18 11.15,23.93
  Top 0.305: 11.15,23.93 RECEIVE.C | R50.2 20.37,23.88
N$11
  Top 0.813: R22.2 R53.2 51.91,31.21 U2.P$5
N$12
  Top 0.61: R24.2 54.93,97.25 MOTOR1.C
N$13
  Top 0.61: R25.2 95.98,41.26 MOTOR2.C
N$14
  Top 0.61: R26.2 39.99,2.74 MOTOR3.C
N$15
  Top 0.61: R27.2 2.74,60.01 MOTOR4.C
N$16
  Top 0.61: IC2.4 R28.2 C17.2
N$17
  Top 0.61: R29.2 C18.1 C17.1
N$18
  Top 0.61: C19.2 R30.2 IC2.6
N$19
  Top 0.813: C21.1 C22.1 R33.2
N$20
  Top 0.406: IC2.8 67.78,21.64
  Top 0.813: R32.2 67.78,21.64 C21.2
N$21
  Top 0.61: R35.2 C24.1 C23.1
N$22
  Top 0.305: R34.2 70.32,22.91 IC2.10
  Top 0.61: R34.2 C23.2
N$23
  Top 0.305: R49.1 SEND.A
N$25  (via drill 0.6)
  Top 0.305: v50,89.37 J2.SIG SJ1.1
N$26  (via drill 0.25)
  Top 0.305: v16.17,22.87 R21.2
  Bottom 0.305: U$17.P$3 16.44,23.15 v16.17,22.87
N$28
  Top 0.305: C6.2 45.43,28.54 U2.P$8
  pour Top (no thermals): 28.41,32.22 33.49,32.22 43.65,28.41 46.19,28.41 48.22,30.29 48.17,32.17 47.61,39.13 45.58,41.92 36.18,40.65 27.14,34.76 27.14,33.49
N$29
  Top 0.406: R45.2 4.28,32.22 4.91,31.59 IC1.5
N$30
  Top 0.305: R46.1 27.14,31.56 24.24,34.45 24.24,40.7 23.2,41.74 IC1.12
N$31  (via drill 0.6)
  Top 0.305: SJ4.1 J5.SIG v10.63,50
N$32  (via drill 0.6)
  Top 0.305: SJ2.1 J4.SIG v89.37,50
N$33
  Top 0.305: R47.1 LED2.A
N$34
  Top 0.305: R48.1 LED3.A
N$35  (via drill 0.6)
  Top 0.305: v50,10.63 J3.SIG SJ3.1
N$37
  pour Top: 23.63,13.17 23.63,5.7 34.46,0.22 34.46,7.02 29.78,12.05 29.27,13.88 24.4,13.88
OPT_SIG  (via drill 0.25)
  Top 0.305: U3.P$23 77.46,68.32 v77.51,68.31 | U$16.SIG 94.2,49.31 94.2,52.9 88.41,58.69 80.94,58.69 80.02,59.6 74.99,59.6 74.79,59.8 v74.79,61.53
  Bottom 0.305: v74.79,61.53 74.84,61.43 77.74,64.33 77.74,68.09 v77.51,68.31
PING0  (via drill 0.25)
  Top 0.254: v81.85,66 82.04,66.19 U3.P$1
  Top 0.305: v77.58,33.69 77.74,33.85 v83.22,33.85
  Bottom 0.305: v77.58,33.69 77.13,33.69 76.82,34 76.82,58.84 81.85,63.87 v81.85,66 | v83.22,33.85 88.52,28.55 U$10.SIG
RESET  (via drill 0.25 pad 0.61)
  Top 0.305: J1.P$3 91.53,67.78 R7.1 S2.P$1 92.33,64.36 92.82,63.87 92.82,61.73 92.33,61.24 S2.P$3 | U3.P$29 78.34,67.52 78.65,67.83 v78.65,70.7
  Bottom 0.305: v78.65,70.7 78.8,70.88 88.43,70.88 J1.P$3
RF_SEL_3V
  Top 0.305: IC1.8 23,31.59 24.24,30.34 24.24,29.43 25.92,27.75 28.05,27.75 28.88,26.93 R3.1
  Top 0.813: T1.2 31.11,26.93 R3.1
RF_SEL_5V  (via drill 0.25)
  Top 0.305: R50.1 R49.2 16.47,25.96 16.47,39.79 15.86,40.4 15.86,41.16 16.47,41.77 18.15,41.77 19.98,43.6 v20.43,43.6 | v34,25.92 34.45,25.92 34.76,26.23 R6.1 | v77.58,69.81 77.58,72.56 76.74,73.4 U3.P$14
  Top 0.406: R6.1 34.11,26.93 T1.1 | R50.1 18.67,24.94 v19.37,24.24
  Bottom 0.305: 33.85,24.24 v19.37,24.24 | 33.85,24.24 34,24.09 38.88,24.09 40.86,22.11 64.48,22.11 65.7,23.33 65.7,38.42 67.68,40.4 73.77,40.4 74.54,41.16 74.54,60.36 78.19,64.02 78.19,69.05 77.58,69.66 v77.58,69.81 | 33.85,24.24 33.85,25.77 v34,25.92 | U$17.P$14 v20.44,43.59 v20.43,43.6
RSSI  (via drill 0.25)
  Top 0.305: U3.P$26 75.94,64.81 v73.62,62.5 | 6.67,34.15 IC1.4 7.76,34.12 v8.24,34.15 | v33.39,26.53 32.47,26.53 31.86,25.92 28.51,25.92 v27.9,26.53
  Bottom 0.305: v73.62,62.5 73.62,41.77 73.16,41.31 67.07,41.31 64.78,39.03 64.78,23.94 63.87,23.02 41.47,23.02 39.18,25.31 37.05,25.31 35.67,26.68 33.54,26.68 v33.39,26.53 | v27.9,26.53 27.75,26.53 20.13,34.15 v8.24,34.15
RXD1
  Top 0.305: J7.3 51,5.26 51.37,4.89 53.35,4.89 57.16,8.7 57.16,33.24 57.42,33.49 IC3.P17
SCK  (via drill 0.25)
  Top 0.305: U3.P$17 73.84,73.84 v73.93,73.93 | v18.45,40.86 17.39,39.79 17.39,31.56 21.04,27.9 22.42,27.9 28.21,22.11 v28.21,21.96
  Bottom 0.305: v73.93,73.93 73.93,73.32 75.91,71.34 87.45,71.34 J1.P$2 89.78,71.64 90.69,69.96 90.69,66.92 87.95,64.17 82.92,64.17 77.28,58.53 77.28,35.06 78.65,33.69 78.65,26.23 73.62,21.2 51.07,21.2 50.61,20.74 49.39,20.74 48.93,21.2 35.67,21.2 35.22,21.65 28.51,21.65 v28.21,21.96 | U$17.P$13 18.44,41.33 v18.45,40.86
SCL_1V8  (via drill 0.25)
  Top 0.305: IC3.P31 63.31,51.27 v63.56,51.52 | v66.31,60.82 66.31,61.85 R1.1
  Top 0.813: T3.2 65.33,61.76 R1.1
  Bottom 0.305: v63.56,51.52 63.56,52.59 67.07,56.1 67.07,60.36 v66.31,60.82
SCL_5V  (via drill 0.25)
  Top 0.305: 71.59,61.85 R2.1 | v71.64,61.28 71.64,61.8 71.59,61.85 | 71.59,61.85 73.89,61.85 76.06,64.02 76.67,64.02 77.54,64.89 U3.P$28
  Top 0.813: R2.1 69.67,61.85 T3.1
  Bottom 0.305: SV1.4 70.32,52.39 69.96,52.74 69.96,60.67 70.27,60.97 71.34,60.97 v71.64,61.28
SDA_1V8  (via drill 0.25)
  Top 0.305: IC3.P32 41.49,52.31 v41.92,52.74 | v63.87,67.83 63.87,66.15 64.36,65.66 R9.1
  Top 0.813: T4.2 65.33,65.57 R9.1
  Route2 0.305: v41.92,52.74 41.92,62.34 47.87,68.29 63.41,68.29 v63.87,67.83
SDA_5V  (via drill 0.25)
  Top 0.305: U3.P$27 76.74,65 v76.67,64.94 | v69.96,68.41 70.32,67.93 R10.1
  Top 0.813: R10.1 69.62,67.36 T4.1
  Bottom 0.305: SV1.3 68.64,48.73 68.44,48.93 68.44,54.42 69.51,55.49 69.51,64.94 | 69.51,64.94 v76.67,64.94 | 69.51,64.94 69.51,67.83 v69.96,68.41
TXD1  (via drill 0.25)
  Top 0.305: J7.2 49,5.26 v48.02,4.28 | v40.09,10.53 40.09,18.45 v40.86,19.19 | v39.84,33.49 IC3.P18
  Route2 0.305: v48.02,4.28 44.97,4.28 40.09,9.16 v40.09,10.53 | v40.86,24.55 v40.86,19.19
  Bottom 0.305: v40.86,24.55 40.86,32.47 v39.84,33.49
VCC  (via drill 0.25)
  Top 0.406: v32.63,29.12 31.56,29.12 T1.3 31.06,28.62 R3.2 | v32.63,25.16 32.42,24.96 T2.3 31.06,24.82 R4.2 | v4.28,39.2 R45.1
  Top 0.813: 29.41,28.89 R3.2 | 29.41,28.89 C1.1 | 29.41,28.89 29.36,28.83 R46.2 26.36,28.83 25.77,29.43 25.77,31.71 23.36,34.12 IC1.9 20.92,34.12 19.52,35.52 19.52,38.44 20.28,39.2 | 20.92,39.2 IC1.11 20.28,39.2 | v20.16,39.2 20.28,39.2 | v30.95,47.16 31.59,48.09 C8.1
  Bottom 0.305: v20.16,39.2 v4.28,39.2
  Bottom 0.406: v32.63,29.12 v32.63,25.16
  Bottom 0.813: v20.16,39.2 22.7,39.2 29.53,47.16 v30.95,47.16
  pour Top (no thermals): 30.32,46.19 28.41,46.19 28.41,48.09 29.68,49.37 31.13,50.74 32.07,50.71 32.07,47.79

### Text on the board
tPlace: P-FET
bPlace: MAAV_Spine 12v0
tNames: GND | +5V | SDA | SCL | +5V | GND
bNames: SDA | SCL | +5V | GND